# EAGLE board VNA (EAGLE 9.3.1), part 1 of 3
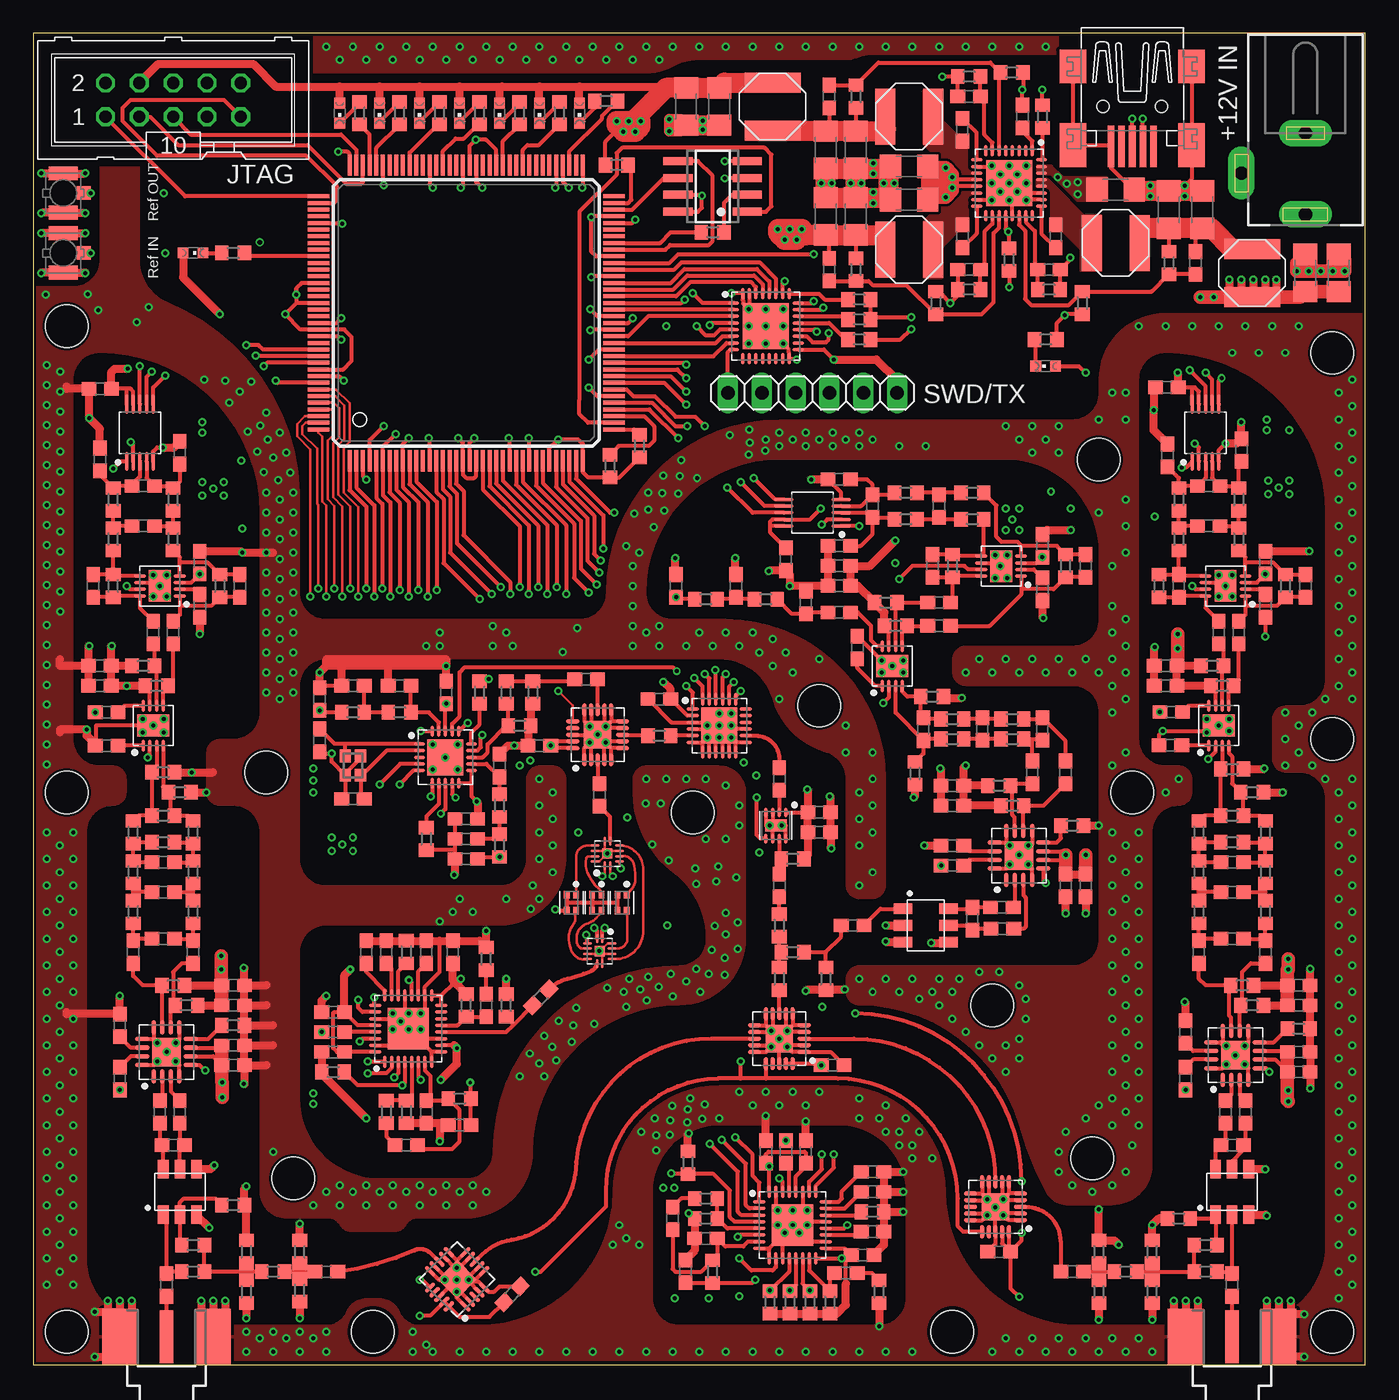
[diagram p10: board, top side]
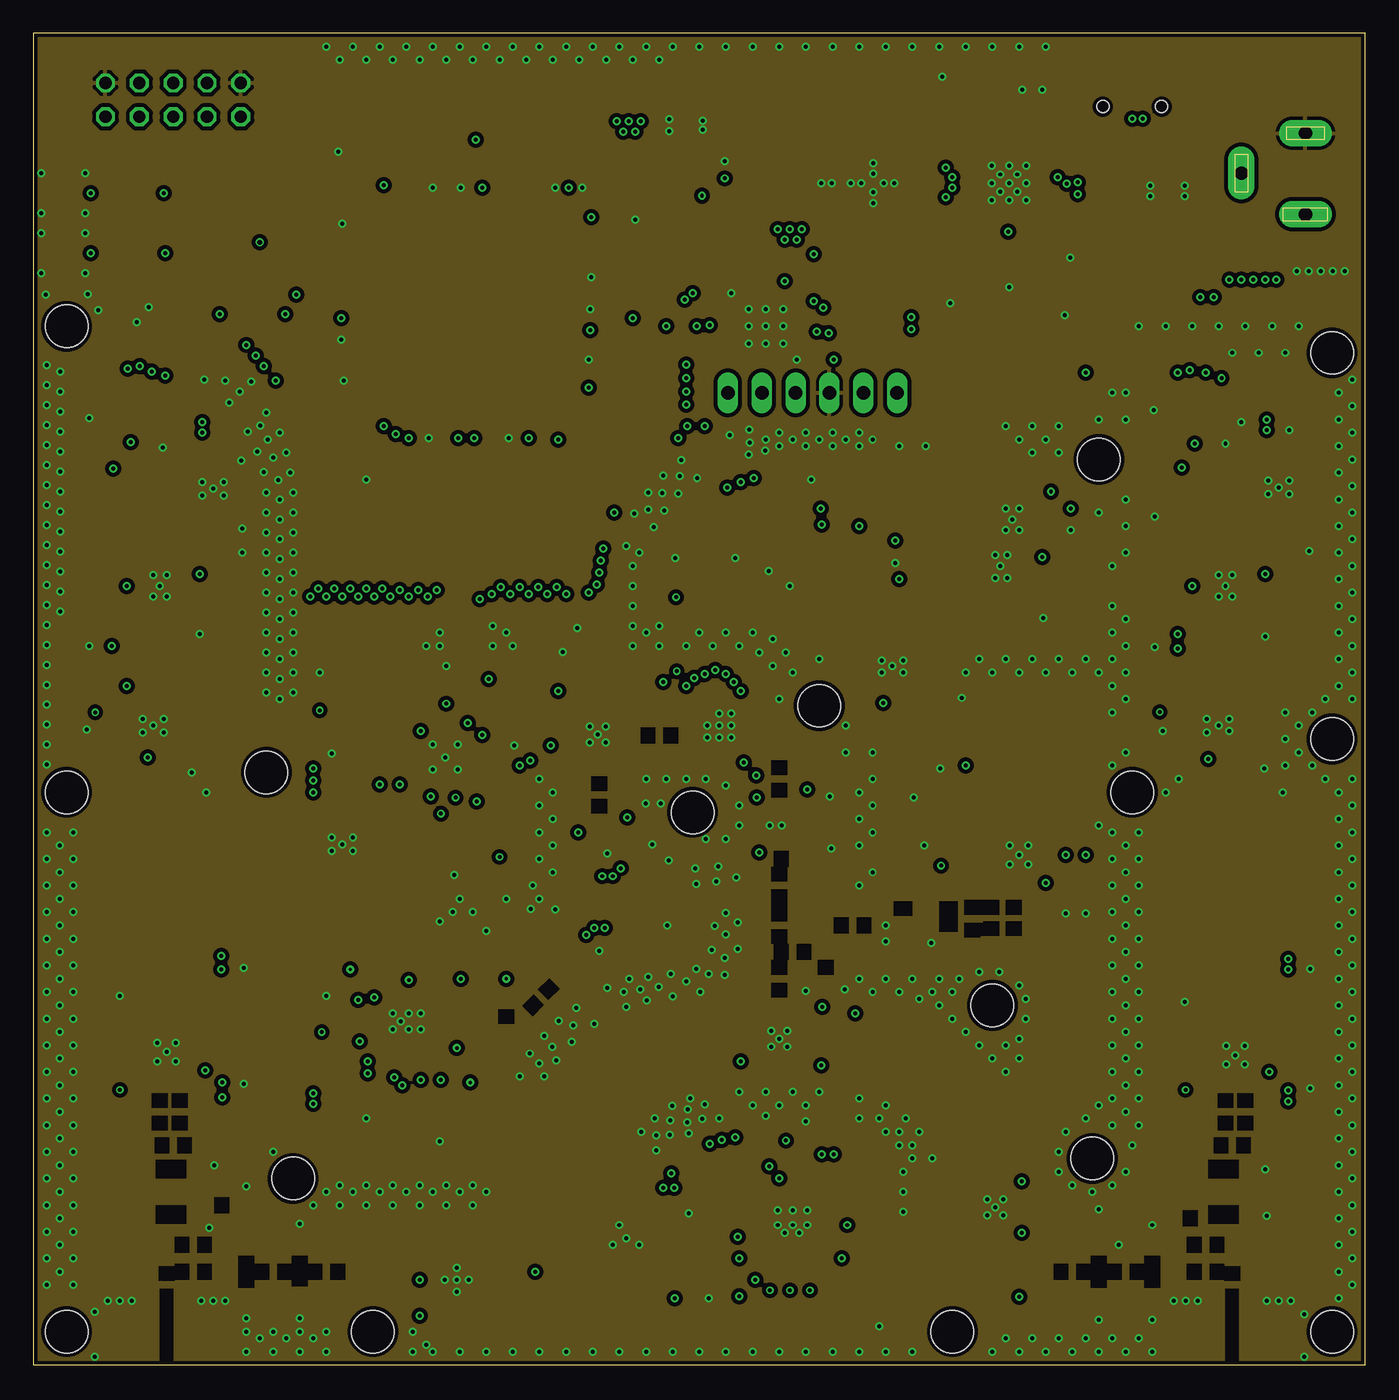
[diagram p11: board, inner layer Route2]
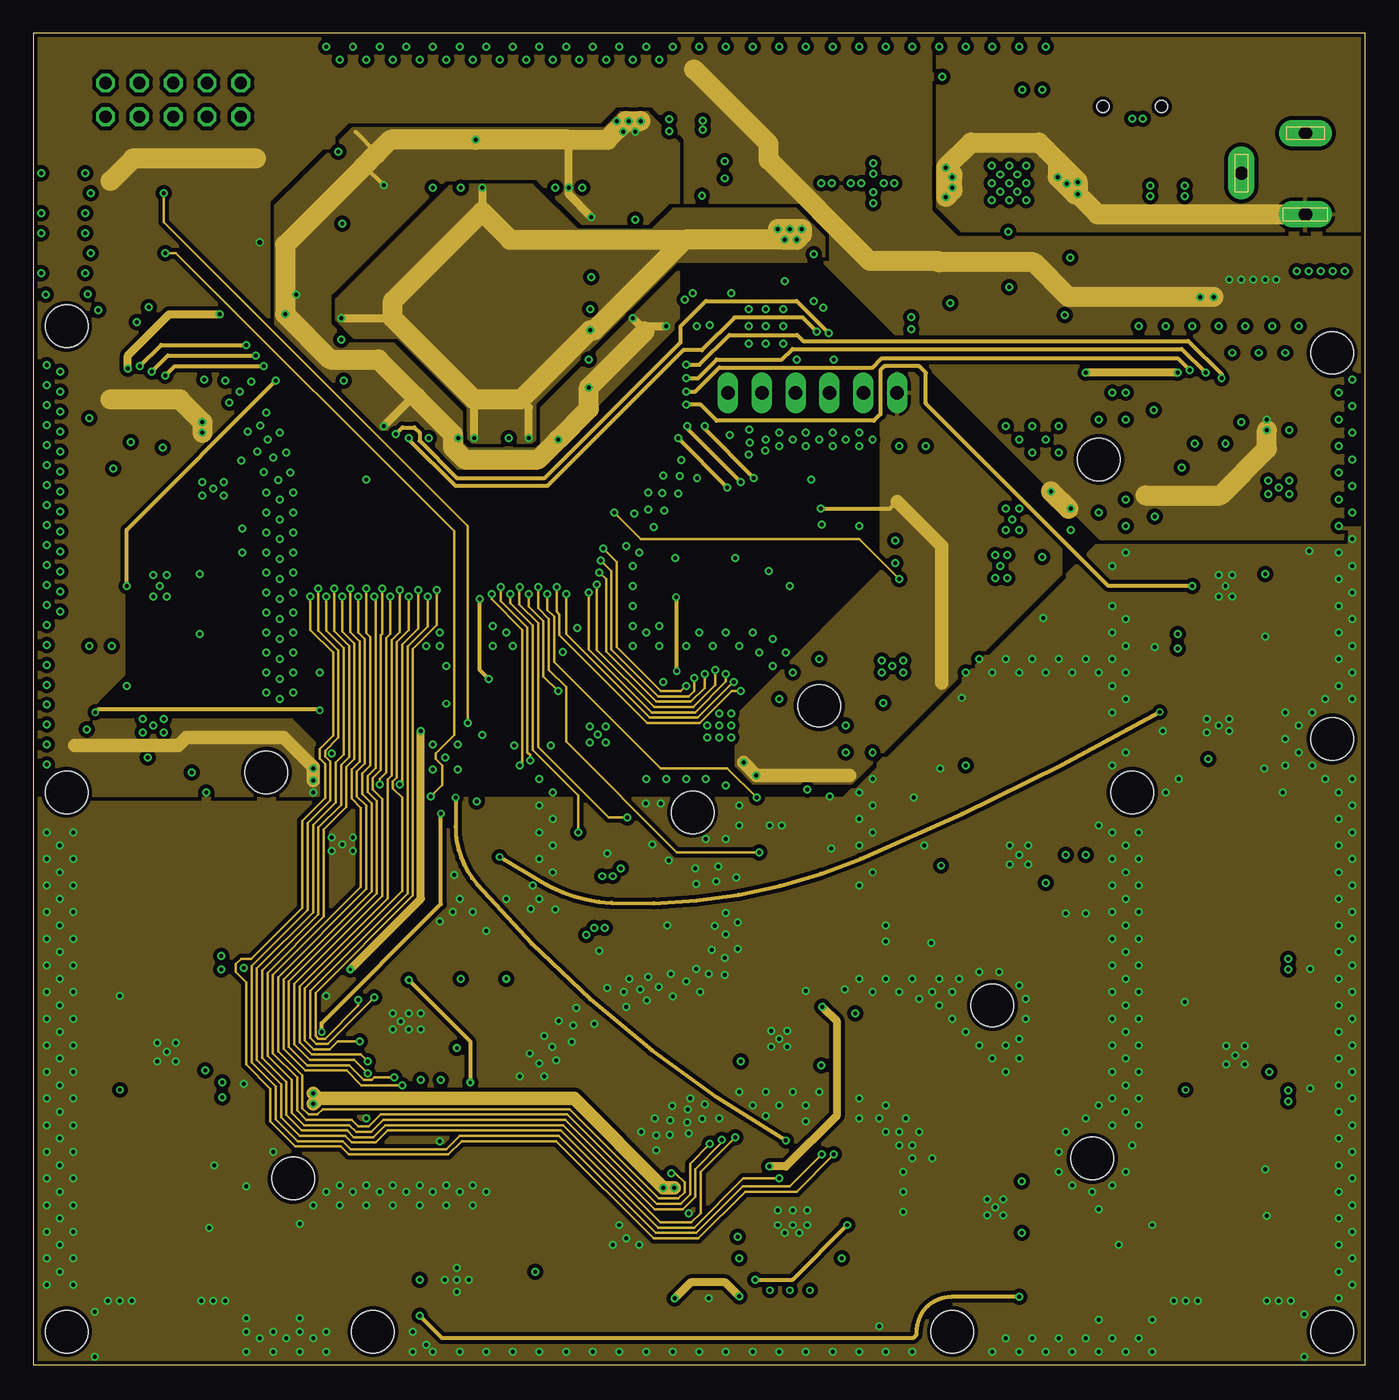
[diagram p12: board, inner layer Route15]
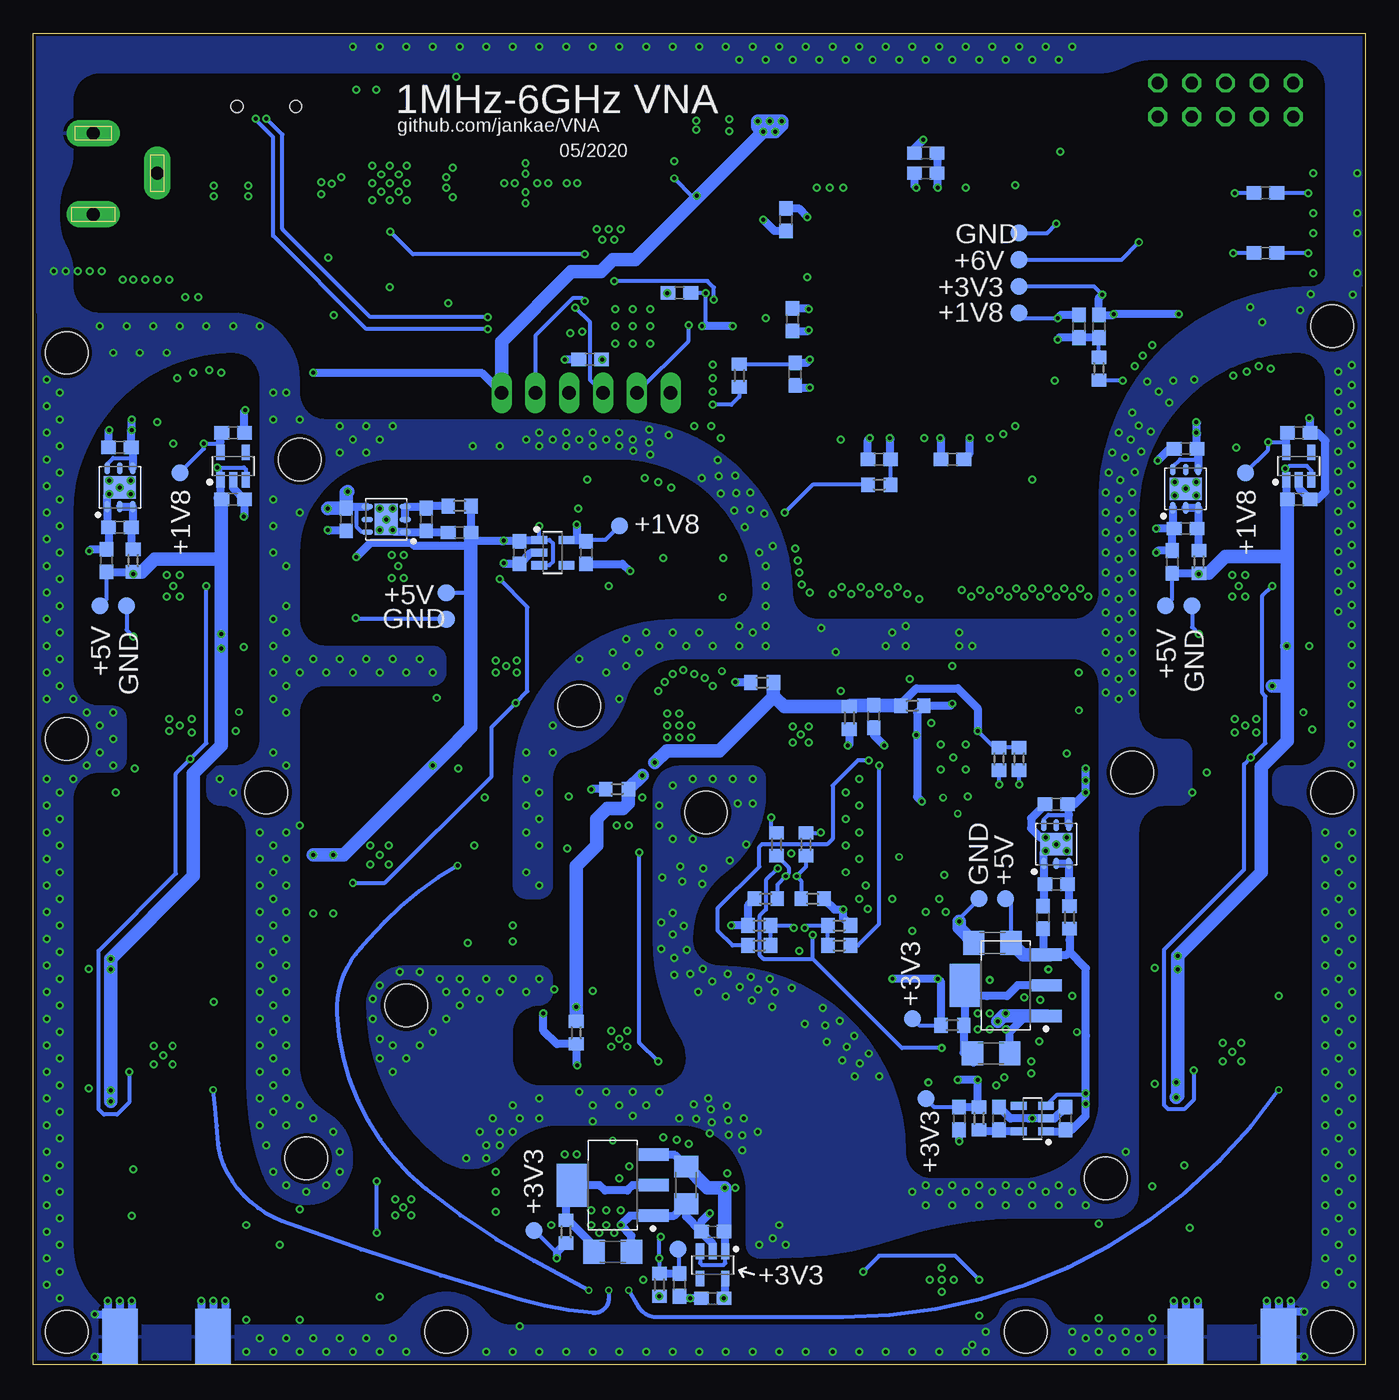
[diagram p13: board, bottom side, seen from below]

Size 100 x 100 mm. Coordinates in mm from the lower left corner, seen from the top.
Outline: 0,0 100,0 100,100 0,100 0,0
Copper layers (1+2*15+16): Top 0.035mm / dielectric 0.2mm / Route2 0.0175mm / dielectric 1.064mm / Route15 0.0175mm / dielectric 0.2mm / Bottom 0.035mm
Design rules "JLCPCB4L_7628 *": minimum track width 6mil, minimum drill 0.2mm, track to track 3.5mil, track to pad 3.5mil, pad to pad 3.5mil, via to via 3.5mil, smd to smd 0mil, copper to edge 0.2mm, drill to drill 0.2mm, minimum pad ring 10mil, minimum via ring 0.125mm, stop-mask expansion 4mil, vias tented up to drill 0mil, thermal gap 10mil
Holes 3.2 mm at 25.5,2.5 2.5,2.5 69,2.5 97.5,2.5 19.5,14 17.5,44.5 2.5,43 82.5,43 97.5,47 79.5,15.5 72,27 49.5,41.5 59,49.5 97.5,76 80,68 2.5,78

## Footprints (pad centres in the part's own frame; a part is rotated, then mirrored left to right if it is on the bottom)
C0603 = smd 1.1 x 1: 1 -0.85,0; 2 0.85,0
C1206 = smd 1.6 x 1.8: 1 -1.4,0; 2 1.4,0
QFN65P400X400X75-17T215N = smd 1.07 x 0.32: 1 -1.83,0.975; 2 -1.83,0.325; 3 -1.83,-0.325; 4 -1.83,-0.975; 9 1.83,-0.975; 10 1.83,-0.325; 11 1.83,0.325; 12 1.83,0.975 | smd 0.32 x 1.07: 5 -0.975,-1.83; 6 -0.325,-1.83; 7 0.325,-1.83; 8 0.975,-1.83; 13 0.975,1.83; 14 0.325,1.83; 15 -0.325,1.83; 16 -0.975,1.83 | smd 2.15 x 2.15: 17 0,0
SON50P300X300X80-9T165X238 = smd 0.917 x 0.27: 1 -1.497,0.75; 2 -1.497,0.25; 3 -1.497,-0.25; 4 -1.497,-0.75; 5 1.497,-0.75; 6 1.497,-0.25; 7 1.497,0.25; 8 1.497,0.75 | smd 1.65 x 2.38: 9 0,0
SOP50P490X110-10N = smd 1.471 x 0.28: 1 -2.15,1; 2 -2.15,0.5; 3 -2.15,0; 4 -2.15,-0.5; 5 -2.15,-1; 6 2.15,-1; 7 2.15,-0.5; 8 2.15,0; 9 2.15,0.5; 10 2.15,1
QFN50P400X400X90-21T270N = smd 0.838 x 0.27: 1 -1.946,1; 2 -1.946,0.5; 3 -1.946,0; 4 -1.946,-0.5; 5 -1.946,-1; 11 1.946,-1; 12 1.946,-0.5; 13 1.946,0; 14 1.946,0.5; 15 1.946,1 | smd 0.27 x 0.838: 6 -1,-1.946; 7 -0.5,-1.946; 8 0,-1.946; 9 0.5,-1.946; 10 1,-1.946; 16 1,1.946; 17 0.5,1.946; 18 0,1.946; 19 -0.5,1.946; 20 -1,1.946 | smd 2.7 x 2.7: 21 0,0
QFN50P500X500X80-33T310 = smd 0.937 x 0.27: 1 -2.487,1.75; 2 -2.487,1.25; 3 -2.487,0.75; 4 -2.487,0.25; 5 -2.487,-0.25; 6 -2.487,-0.75; 7 -2.487,-1.25; 8 -2.487,-1.75; 17 2.487,-1.75; 18 2.487,-1.25; 19 2.487,-0.75; 20 2.487,-0.25; 21 2.487,0.25; 22 2.487,0.75; 23 2.487,1.25; 24 2.487,1.75 | smd 0.27 x 0.937: 9 -1.75,-2.487; 10 -1.25,-2.487; 11 -0.75,-2.487; 12 -0.25,-2.487; 13 0.25,-2.487; 14 0.75,-2.487; 15 1.25,-2.487; 16 1.75,-2.487; 25 1.75,2.487; 26 1.25,2.487; 27 0.75,2.487; 28 0.25,2.487; 29 -0.25,2.487; 30 -0.75,2.487; 31 -1.25,2.487; 32 -1.75,2.487 | smd 3.1 x 3.1: 33 0,0
SOT95P240X110-5 = smd 1.18 x 0.609: 1 -1.024,0.95; 2 -1.024,0; 3 -1.024,-0.95; 4 1.024,-0.95; 5 1.024,0.95
QFN40P180X180X55-13T76N = smd 0.688 x 0.2: 1 -0.921,0.2; 2 -0.921,-0.2; 7 0.921,-0.2; 8 0.921,0.2 | smd 0.2 x 0.688: 3 -0.6,-0.921; 4 -0.2,-0.921; 5 0.2,-0.921; 6 0.6,-0.921; 9 0.6,0.921; 10 0.2,0.921; 11 -0.2,0.921; 12 -0.6,0.921 | smd 0.76 x 0.76: 13 0,0
SOT230P700X180-4 = smd 2.265 x 0.929: 1 -3.073,2.3; 2 -3.073,0; 3 -3.073,-2.3 | smd 2.265 x 3.229: 4 3.073,0
QFN50P400X400X75-21T206 = smd 0.962 x 0.282: 1 -1.875,1; 2 -1.875,0.5; 3 -1.875,0; 4 -1.875,-0.5; 5 -1.875,-1; 11 1.875,-1; 12 1.875,-0.5; 13 1.875,0; 14 1.875,0.5; 15 1.875,1 | smd 0.282 x 0.962: 6 -1,-1.875; 7 -0.5,-1.875; 8 0,-1.875; 9 0.5,-1.875; 10 1,-1.875; 16 1,1.875; 17 0.5,1.875; 18 0,1.875; 19 -0.5,1.875; 20 -1,1.875 | smd 2.06 x 2.06: 21 0,0
QFN50P400X400X75-25T270 = smd 0.96 x 0.27: 1 -1.985,1.25; 2 -1.985,0.75; 3 -1.985,0.25; 4 -1.985,-0.25; 5 -1.985,-0.75; 6 -1.985,-1.25; 13 1.985,-1.25; 14 1.985,-0.75; 15 1.985,-0.25; 16 1.985,0.25; 17 1.985,0.75; 18 1.985,1.25 | smd 0.27 x 0.96: 7 -1.25,-1.985; 8 -0.75,-1.985; 9 -0.25,-1.985; 10 0.25,-1.985; 11 0.75,-1.985; 12 1.25,-1.985; 19 1.25,1.985; 20 0.75,1.985; 21 0.25,1.985; 22 -0.25,1.985; 23 -0.75,1.985; 24 -1.25,1.985 | smd 2.7 x 2.7: 25 0,0
SON50P200X200X80-9T90X160N = smd 0.76 x 0.279: 1 -0.985,0.75; 2 -0.985,0.25; 3 -0.985,-0.25; 4 -0.985,-0.75; 5 0.985,-0.75; 6 0.985,-0.25; 7 0.985,0.25; 8 0.985,0.75 | smd 0.9 x 1.6: 9 0,0
SON95P300X300X100-7T170X240N = smd 0.86 x 0.397: 1 -1.435,0.95; 2 -1.435,0; 3 -1.435,-0.95; 4 1.435,-0.95; 5 1.435,0; 6 1.435,0.95 | smd 1.7 x 2.4: 7 0,0
QFN50P500X500X100-33T345N = smd 0.86 x 0.27: 1 -2.435,1.75; 2 -2.435,1.25; 3 -2.435,0.75; 4 -2.435,0.25; 5 -2.435,-0.25; 6 -2.435,-0.75; 7 -2.435,-1.25; 8 -2.435,-1.75; 17 2.435,-1.75; 18 2.435,-1.25; 19 2.435,-0.75; 20 2.435,-0.25; 21 2.435,0.25; 22 2.435,0.75; 23 2.435,1.25; 24 2.435,1.75 | smd 0.27 x 0.86: 9 -1.75,-2.435; 10 -1.25,-2.435; 11 -0.75,-2.435; 12 -0.25,-2.435; 13 0.25,-2.435; 14 0.75,-2.435; 15 1.25,-2.435; 16 1.75,-2.435; 25 1.75,2.435; 26 1.25,2.435; 27 0.75,2.435; 28 0.25,2.435; 29 -0.25,2.435; 30 -0.75,2.435; 31 -1.25,2.435; 32 -1.75,2.435 | smd 3.45 x 3.45: 33 0,0
U.FL_SMT = smd 1.05 x 2.2: GND1 -1.475,0; GND2 1.475,0 | smd 1 x 1.05: SIG 0,-1.525
DCJ0202 = drill 1 pad 2 long: 1 0,3.1; 2 4.8,0; 3 0,-3
1X06 = drill 1.016 long: 1 -6.35,0; 2 -3.81,0; 3 -1.27,0; 4 1.27,0; 5 3.81,0; 6 6.35,0
ML10 = drill 0.914 octagon: 1 -5.08,-1.27; 2 -5.08,1.27; 3 -2.54,-1.27; 4 -2.54,1.27; 5 0,-1.27; 6 0,1.27; 7 2.54,-1.27; 8 2.54,1.27; 9 5.08,-1.27; 10 5.08,1.27
R0603 = smd 1 x 1.1: 1 -0.85,0; 2 0.85,0
SRN5040 = smd 1.5 x 4.2: P$1 -1.8,0; P$2 1.8,0
CHIPLED_0603 = smd 0.8 x 0.8: A 0,-0.75; C 0,0.75
FILTRDFN160X84X70-4N = smd 0.571 x 0.424: 1 -0.6,0.35; 2 -0.6,-0.35; 3 0.6,-0.35; 4 0.6,0.35
FA-128 = smd 0.95 x 0.85: 1 -0.725,-0.575; 2 0.725,-0.575; 3 0.725,0.575; 4 -0.725,0.575
MACOM_BALUN = smd 1.4 x 0.8: 1 -1.715,1.25; 2 -1.715,0; 3 -1.715,-1.25; 4 1.715,-1.25; 5 1.715,0; 6 1.715,1.25
B1,27 = smd 1.27 x 1.27: TP 0,0
TQ144 = smd 1.6 x 0.3: P1 -11.1,8.75; P2 -11.1,8.25; P3 -11.1,7.75; P4 -11.1,7.25; P5 -11.1,6.75; P6 -11.1,6.25; P7 -11.1,5.75; P8 -11.1,5.25; P9 -11.1,4.75; P10 -11.1,4.25; P11 -11.1,3.75; P12 -11.1,3.25; P13 -11.1,2.75; P14 -11.1,2.25; P15 -11.1,1.75; P16 -11.1,1.25; P17 -11.1,0.75; P18 -11.1,0.25; P19 -11.1,-0.25; P20 -11.1,-0.75; P21 -11.1,-1.25; P22 -11.1,-1.75; P23 -11.1,-2.25; P24 -11.1,-2.75; P25 -11.1,-3.25; P26 -11.1,-3.75; P27 -11.1,-4.25; P28 -11.1,-4.75; P29 -11.1,-5.25; P30 -11.1,-5.75; P31 -11.1,-6.25; P32 -11.1,-6.75; P33 -11.1,-7.25; P34 -11.1,-7.75; P35 -11.1,-8.25; P36 -11.1,-8.75; P73 11.1,-8.75; P74 11.1,-8.25; P75 11.1,-7.75; P76 11.1,-7.25; P77 11.1,-6.75; P78 11.1,-6.25; P79 11.1,-5.75; P80 11.1,-5.25; P81 11.1,-4.75; P82 11.1,-4.25; P83 11.1,-3.75; P84 11.1,-3.25; P85 11.1,-2.75; P86 11.1,-2.25; P87 11.1,-1.75; P88 11.1,-1.25; P89 11.1,-0.75; P90 11.1,-0.25; P91 11.1,0.25; P92 11.1,0.75; P93 11.1,1.25; P94 11.1,1.75; P95 11.1,2.25; P96 11.1,2.75; P97 11.1,3.25; P98 11.1,3.75; P99 11.1,4.25; P100 11.1,4.75; P101 11.1,5.25; P102 11.1,5.75; P103 11.1,6.25; P104 11.1,6.75; P105 11.1,7.25; P106 11.1,7.75; P107 11.1,8.25; P108 11.1,8.75 | smd 0.3 x 1.6: P37 -8.75,-11.1; P38 -8.25,-11.1; P39 -7.75,-11.1; P40 -7.25,-11.1; P41 -6.75,-11.1; P42 -6.25,-11.1; P43 -5.75,-11.1; P44 -5.25,-11.1; P45 -4.75,-11.1; P46 -4.25,-11.1; P47 -3.75,-11.1; P48 -3.25,-11.1; P49 -2.75,-11.1; P50 -2.25,-11.1; P51 -1.75,-11.1; P52 -1.25,-11.1; P53 -0.75,-11.1; P54 -0.25,-11.1; P55 0.25,-11.1; P56 0.75,-11.1; P57 1.25,-11.1; P58 1.75,-11.1; P59 2.25,-11.1; P60 2.75,-11.1; P61 3.25,-11.1; P62 3.75,-11.1; P63 4.25,-11.1; P64 4.75,-11.1; P65 5.25,-11.1; P66 5.75,-11.1; P67 6.25,-11.1; P68 6.75,-11.1; P69 7.25,-11.1; P70 7.75,-11.1; P71 8.25,-11.1; P72 8.75,-11.1; P109 8.75,11.1; P110 8.25,11.1; P111 7.75,11.1; P112 7.25,11.1; P113 6.75,11.1; P114 6.25,11.1; P115 5.75,11.1; P116 5.25,11.1; P117 4.75,11.1; P118 4.25,11.1; P119 3.75,11.1; P120 3.25,11.1; P121 2.75,11.1; P122 2.25,11.1; P123 1.75,11.1; P124 1.25,11.1; P125 0.75,11.1; P126 0.25,11.1; P127 -0.25,11.1; P128 -0.75,11.1; P129 -1.25,11.1; P130 -1.75,11.1; P131 -2.25,11.1; P132 -2.75,11.1; P133 -3.25,11.1; P134 -3.75,11.1; P135 -4.25,11.1; P136 -4.75,11.1; P137 -5.25,11.1; P138 -5.75,11.1; P139 -6.25,11.1; P140 -6.75,11.1; P141 -7.25,11.1; P142 -7.75,11.1; P143 -8.25,11.1; P144 -8.75,11.1
SO08 = smd 0.6 x 2.2: 1 -1.905,-2.6; 2 -0.635,-2.6; 3 0.635,-2.6; 4 1.905,-2.6; 5 1.905,2.6; 6 0.635,2.6; 7 -0.635,2.6; 8 -1.905,2.6
J502-ND-142-0711-821/826 = smd 4 x 1: 1 2.115,0 | smd 4.191 x 2.667: G@1 2.115,3.495; G@2 2.115,-3.495 | smd 4.191 x 2.667 bottom: G@3 2.115,3.495; G@4 2.115,-3.495
32005-301 = smd 3.1 x 0.5: 1 3,1.6; 2 3,0.8; 3 3,0; 4 3,-0.8; 5 3,-1.6 | smd 2.5 x 2: M1 -3,-4.45; M2 -3,4.45 | smd 3.3 x 2: M3 2.9,4.45; M4 2.9,-4.45 | hole 0.9: 0,2.2; 0,-2.2

## Placement (x,y rotation side)
C1  100n  [C0603]  10,6 90 top
C2  100n  [C0603]  22,7 180 top
C3  100n  [C0603]  9.5,19 90 top
C4  100n  [C0603]  11,19 90 top
C5  DNP  [C0603]  10.5,16.5 180 top
C6  100n  [C0603]  6.5,25.5 90 top
C7  100n  [C0603]  6.5,21.5 90 top
C8  10n  [C0603]  15,24 0 top
C9  1u  [C0603]  15,22.5 0 top
C10  10n  [C0603]  12,31 90 top
C11  10n  [C0603]  7.5,31 90 top
C12  100n  [C0603]  15,28.5 0 top
C13  100n  [C0603]  15,27 0 top
C14  120p  [C0603]  9.75,32 0 top
C15  100n  [C0603]  5.5,49 0 top
C16  330p  [C0603]  8.25,66 0 top
C17  330p  [C0603]  5,68 270 top
C18  100n  [C0603]  5.5,46.5 0 top
C19  330p  [C0603]  11,68.5 90 top
C20  1u  [C0603]  9,55 90 top
C21  1u  [C0603]  10.5,55 90 top
C22  100n  [C0603]  5,51 0 top
C23  100n  [C0603]  5,52.5 0 top
C24  DNP  [C0603]  4.5,58.5 90 top
C25  DNP  [C0603]  15.5,58.5 270 top
C26  100n  [C0603]  12.5,57 270 top
C27  330p  [C0603]  8.25,63 0 top
C28  1u  [C0603]  85,65 0 bottom
C29  100n  [C0603]  5.02,73.3 0 top
C30  100n  [C0603]  12.5,60.25 270 top
C31  150p  [C0603]  9.75,35.5 0 top
C32  33p  [C0603]  9.75,37.75 0 top
C33  100n  [C0603]  90,6 90 top
C34  100n  [C0603]  78,7 0 top
C35  100n  [C0603]  89.5,19 90 top
C36  100n  [C0603]  91,19 90 top
C37  DNP  [C0603]  90,16.5 180 top
C38  100n  [C0603]  86.5,25 90 top
C39  100n  [C0603]  86.5,21.5 90 top
C40  10n  [C0603]  95,22 0 top
C41  1u  [C0603]  95,23.5 0 top
C42  10n  [C0603]  87.5,31 90 top
C43  100n  [C0603]  95,28.5 0 top
C44  100n  [C0603]  95,27 0 top
C45  100n  [C0603]  85.37,46.53 0 top
C46  1u  [C0603]  89,55 90 top
C47  1u  [C0603]  90.5,55 90 top
C48  100n  [C0603]  85,51 0 top
C49  100n  [C0603]  85,52.5 0 top
C50  DNP  [C0603]  86,58.5 90 top
C51  DNP  [C0603]  95.5,58.5 270 top
C52  100n  [C0603]  92.5,57 270 top
C53  330p  [C0603]  88.25,63 0 top
C54  100n  [C0603]  92.5,60.25 270 top
C55  10n  [C0603]  92.5,31 90 top
C56  120p  [C0603]  90,32 0 top
C57  150p  [C0603]  90,35.5 0 top
C58  33p  [C0603]  90,37.75 0 top
C59  100n  [C0603]  85.42,49.03 0 top
C60  330p  [C0603]  88.25,66 0 top
C61  330p  [C0603]  85.15,68.3 270 top
C62  330p  [C0603]  90.7,68.7 90 top
C63  1u  [C0603]  85,70 0 bottom
C64  100n  [C0603]  85.1,73.4 0 top
C65  10n  [C0603]  7.5,88 0 bottom
C66  100n  [C0603]  61.5,33 0 top
C67  100n  [C0603]  72.72,34.36 0 top
C68  100n  [C0603]  72.75,32.75 0 top
C69  DNP  [C0603]  70.5,33.5 90 top
C70  100n  [C0603]  69,39 180 top
C71  100n  [C0603]  69,37.5 0 top
C72  10n  [C0603]  79,36 270 top
C73  1u  [C0603]  77.5,36 270 top
C74  10n  [C0603]  75,44.5 90 top
C75  100n  [C0603]  69,42 180 top
C76  100n  [C0603]  69,43.5 180 top
C77  100n  [C0603]  61.86,53.88 270 top
C78  1u  [C0603]  68,57.25 0 top
C79  1u  [C0603]  68,55.5 0 top
C80  100n  [C0603]  60.5,58.5 0 top
C81  100n  [C0603]  60.5,60 0 top
C82  DNP  [C0603]  67.5,60 90 top
C83  DNP  [C0603]  79,60 270 top
C84  100n  [C0603]  75.75,58.25 270 top
C85  330p  [C0603]  68,64.5 90 top
C86  100n  [C0603]  75.75,61.5 270 top
C87  10n  [C0603]  77.5,44.5 90 top
C88  120p  [C0603]  75.75,47.75 90 top
C89  150p  [C0603]  71.25,47.75 90 top
C90  33p  [C0603]  66.82,47.74 90 top
C91  100n  [C0603]  60.5,56.5 0 top
C92  330p  [C0603]  63,64.5 90 top
C93  330p  [C0603]  60.5,61.5 0 top
C94  330p  [C0603]  60.5,66.5 180 top
C95  1u  [C0603]  63.5,61 270 bottom
C96  100n  [C0603]  56.5,60.5 90 top
C97  18p  [C0603]  21.5,50 90 top
C98  56p  [C0603]  24,51 180 top
C99  18p  [C0603]  27.5,51 180 top
C100  18p  [C0603]  32.5,38 180 top
C101  56p  [C0603]  32.5,39.5 180 top
C102  18p  [C0603]  35,45 90 top
C103  18p  [C0603]  58,57.25 90 top
C104  100n  [C0603]  32.5,41 0 top
C105  100n  [C0603]  31,50.5 270 top
C106  1u  [C0603]  13.5,68.8 0 bottom
C107  10n  [C0603]  7.5,83.5 180 bottom
C108  4p  [C0603]  24,42.5 0 top
C109  4p  [C0603]  21.5,46.9 90 top
C110  100n  [C0603]  36.9,48.7 90 bottom
C111  56p  [C0603]  52.75,58.5 90 top
C112  18p  [C0603]  48.25,58.5 90 top
C113  4u7  [C0603]  13.5,62.8 0 bottom
C114  1u  [C0603]  25,31 90 top
C115  1u  [C0603]  29.5,31 90 top
C116  1u  [C0603]  26.5,31 90 top
C117  180p  [C0603]  29.5,19 270 top
C118  18p  [C0603]  32,18 0 top
C119  3n3  [C0603]  28,16.5 180 top
C120  100n  [C0603]  22.5,26.5 180 top
C121  10n  [C0603]  42.5,42.8 90 top
C122  1u  [C0603]  63,14.5 0 top
C123  1u  [C0603]  22.5,18.5 90 bottom
C124  1u  [C0603]  27.5,18.5 90 bottom
C125  10u  [C1206]  28,31.7 180 bottom
C126  10u  [C1206]  28.1,23.4 0 bottom
C127  100n  [C0603]  22.5,23.5 180 top
C128  100n  [C0603]  30.5,18.5 270 bottom
C129  100n  [C0603]  31.5,31 90 top
C130  10n  [C0603]  22.5,25 0 top
C131  10n  [C0603]  34,27 270 top
C132  10n  [C0603]  38.1,27.6 45 top
C133  1u  [C0603]  63,10 0 top
C134  1u  [C0603]  63,13 0 top
C135  180p  [C0603]  50.5,9.5 180 top
C136  18p  [C0603]  48.96,7.03 270 top
C137  3n3  [C0603]  48,11 90 top
C138  100n  [C0603]  58,16 90 top
C139  1u  [C0603]  49,10 180 bottom
C140  1u  [C0603]  49,5 180 bottom
C141  10u  [C1206]  51,13.5 270 bottom
C142  10u  [C1206]  56.5,8.5 0 bottom
C143  100n  [C0603]  55,16 90 top
C144  100n  [C0603]  51.5,6 270 bottom
C145  100n  [C0603]  62.25,8.25 0 top
C146  10n  [C0603]  56.5,16 270 top
C147  10n  [C0603]  61,6.9 180 top
C148  100n  [C0603]  47,50 180 top
C149  100n  [C0603]  38,46.5 180 top
C150  100n  [C0603]  56,44 270 top
C151  100n  [C0603]  59,40 0 top
C152  100n  [C0603]  59,41.5 0 top
C153  100n  [C0603]  56,36 270 top
C154  100n  [C0603]  60,22.5 0 top
C155  100n  [C0603]  72.5,8.5 180 top
C156  100n  [C0603]  35.94,5.3 45 top
C157  100n  [C0603]  41.5,51.5 180 top
C158  1u  [C0603]  93.5,68.9 0 bottom
C159  4u7  [C0603]  93.5,62.9 0 bottom
C160  1u  [C0603]  76.5,63.5 90 bottom
C161  4u7  [C0603]  70.5,63.5 90 bottom
C162  1u  [C0603]  23.2,42.1 0 bottom
C163  4u7  [C0603]  23.2,36.1 0 bottom
C164  1u  [C0603]  14.5,60.3 270 bottom
C165  1u  [C0603]  94.5,60.4 270 bottom
C166  1u  [C0603]  68,62.5 0 bottom
C167  1u  [C0603]  24.2,33.6 270 bottom
C168  1u  [C0603]  74.25,93.75 270 top
C169  22u  [C1206]  61.75,91.25 270 top
C170  22u  [C1206]  85.25,86.75 90 top
C171  22u  [C1206]  87.75,86.75 90 top
C172  22u  [C1206]  59.5,91.25 270 top
C173  10u/25V  [C1206]  65.75,90 180 top
C174  22u  [C1206]  98,82 90 top
C175  47n  [C0603]  69.75,92.75 90 top
C176  510p  [C0603]  70.25,95.25 0 top
C177  10u/25V  [C1206]  81.25,88.25 0 top
C178  47n  [C0603]  76.75,84.75 270 top
C179  DNP  [C0603]  59.75,95.25 90 top
C180  22u  [C1206]  61.75,86.25 90 top
C181  22u  [C1206]  95.5,82 90 top
C182  120p  [C0603]  76.25,82.25 180 top
C183  DNP  [C0603]  87.25,82.75 270 top
C184  22u  [C1206]  59.5,86.25 90 top
C185  10u/25V  [C1206]  65.75,87.5 180 top
C186  47n  [C0603]  69.75,84.75 270 top
C187  1n  [C0603]  70.25,82.25 0 top
C188  8p2  [C0603]  59.75,82.25 270 top
C189  22u  [C1206]  51.5,94.5 270 top
C190  22u  [C1206]  49,94.5 270 top
C191  100n  [C0603]  58.2,75.5 0 bottom
C192  100n  [C0603]  51.5,80.5 180 bottom
C193  1u  [C0603]  5,65 0 bottom
C194  1u  [C0603]  5,70 0 bottom
C195  1u  [C0603]  58.5,61 270 bottom
C203  100n  [C0603]  33,91 0 bottom
C204  100n  [C0603]  43.5,86 270 bottom
C205  100n  [C0603]  42.8,74.4 90 bottom
C206  100n  [C0603]  31,68 0 bottom
C207  100n  [C0603]  20,78 270 bottom
C208  100n  [C0603]  33,89.5 0 bottom
C209  100n  [C0603]  43,78.5 90 bottom
C210  100n  [C0603]  36.5,68 0 bottom
C211  100n  [C0603]  21.5,78 270 bottom
IC1  LTC5510  [QFN65P400X400X75-17T215N]  10,23.5 90 top
IC2  LT5560  [SON50P300X300X80-9T165X238]  9,48 90 top
IC3  LTC6362  [SON50P300X300X80-9T165X238]  9.5,58.5 180 top
IC4  MCP33131D-10-E/MS  [SOP50P490X110-10N]  8,70 90 top
IC5  LTC5510  [QFN65P400X400X75-17T215N]  90.25,23.25 90 top
IC6  LT5560  [SON50P300X300X80-9T165X238]  89,48 90 top
IC7  LTC6362  [SON50P300X300X80-9T165X238]  89.5,58.5 180 top
IC8  MCP33131D-10-E/MS  [SOP50P490X110-10N]  88,70 90 top
IC9  LTC5510  [QFN65P400X400X75-17T215N]  74,38.25 90 top
IC10  LT5560  [SON50P300X300X80-9T165X238]  64.48,52.48 90 top
IC11  LTC6362  [SON50P300X300X80-9T165X238]  72.66,59.98 180 top
IC12  MCP33131D-10-E/MS  [SOP50P490X110-10N]  58.5,64 180 top
IC13  SI5351C  [QFN50P400X400X90-21T270N]  30.94,45.63 0 top
IC14  MAX2871  [QFN50P500X500X80-33T310]  28.15,25.25 90 top
IC15  NCP702-3.3  [SOT95P240X110-5]  25,18.5 180 bottom
IC16  RFSW6042  [QFN40P180X180X55-13T76N]  42.52,31.07 270 top
IC17  AP2114H  [SOT230P700X180-4]  27,28.5 180 bottom
IC18  RFSW6042  [QFN40P180X180X55-13T76N]  43.1,38.4 90 top
IC19  MAX2871  [QFN50P500X500X80-33T310]  57,10.5 0 top
IC20  NCP702-3.3  [SOT95P240X110-5]  49,7.5 270 bottom
IC21  AP2114H  [SOT230P700X180-4]  56.5,13.5 180 bottom
IC22  F2912  [QFN50P400X400X75-21T206]  42.37,47.32 90 top
IC23  F1958  [QFN50P400X400X75-25T270]  51.5,48 0 top
IC24  TRF37A73  [SON50P200X200X80-9T90X160N]  55.75,40.5 270 top
IC25  F2912  [QFN50P400X400X75-21T206]  56,24.5 180 top
IC26  F2912  [QFN50P400X400X75-21T206]  31.81,6.43 135 top
IC27  F2912  [QFN50P400X400X75-21T206]  72.23,11.87 180 top
IC28  LDL212PU50R  [SON95P300X300X100-7T170X240N]  13.5,65.8 90 bottom
IC29  LDL212PU50R  [SON95P300X300X100-7T170X240N]  93.5,65.9 90 bottom
IC30  LDL212PU50R  [SON95P300X300X100-7T170X240N]  73.5,63.5 180 bottom
IC31  LDL212PU50R  [SON95P300X300X100-7T170X240N]  23.2,39.1 90 bottom
IC32  TPS65265  [QFN50P500X500X100-33T345N]  73.25,88.75 270 top
IC33  STM32L432KC  [QFN50P500X500X100-33T345N]  55,78 0 top
IC34  NCP702-1.8  [SOT95P240X110-5]  5,67.5 90 bottom
IC35  NCP702-1.8  [SOT95P240X110-5]  85,67.5 90 bottom
IC36  NCP702-1.8  [SOT95P240X110-5]  61,61 0 bottom
J1  U.FL-R-SMT  [U.FL_SMT]  2.25,83.5 90 top
J2  U.FL-R-SMT  [U.FL_SMT]  2.25,88 90 top
J3  DCJ0202  [DCJ0202]  95.5,89.5 180 top
JP1  [1X06]  58.5,73 180 top
JTAG  [ML10]  10.5,95 0 top
L1  330n  [R0603]  10.5,28.5 180 top
L2  330n  [R0603]  11.5,27 180 top
L3  330n  [R0603]  9.75,44.5 0 top
L4  220Ohm  [R0603]  6,65 90 top
L5  220Ohm  [R0603]  10.5,65 90 top
L6  330n  [R0603]  90.75,28.5 180 top
L7  68n  [R0603]  7.5,34 90 top
L8  68n  [R0603]  12,34 90 top
L9  33n  [R0603]  7.5,37 90 top
L10  33n  [R0603]  12,37 90 top
L11  330n  [R0603]  11,43 0 top
L12  330n  [R0603]  91.5,27 180 top
L13  68n  [R0603]  87.5,34 90 top
L14  68n  [R0603]  92.5,34 90 top
L15  33n  [R0603]  87.5,37 90 top
L16  33n  [R0603]  92.5,37 90 top
L17  330n  [R0603]  90,44.75 0 top
L18  330n  [R0603]  91.5,43 0 top
L19  220Ohm  [R0603]  86,65 90 top
L20  220Ohm  [R0603]  90.5,65 90 top
L21  330n  [R0603]  72.5,43.5 0 top
L22  330n  [R0603]  73.5,42 0 top
L23  68n  [R0603]  73.5,47 180 top
L24  68n  [R0603]  73.5,48.5 180 top
L25  33n  [R0603]  69,47 180 top
L26  33n  [R0603]  69,48.5 180 top
L27  330n  [R0603]  66.19,44.43 270 top
L28  330n  [R0603]  67.47,50.19 0 top
L29  220Ohm  [R0603]  65.5,63.5 180 top
L30  220Ohm  [R0603]  65.5,65.5 180 top
L31  Ferrite  [R0603]  34,49.5 0 bottom
L32  120n  [R0603]  24,49 180 top
L33  120n  [R0603]  27.5,49 180 top
L34  120n  [R0603]  35,39 270 top
L35  120n  [R0603]  35,42 270 top
L36  120n  [R0603]  55,57.5 0 top
L37  120n  [R0603]  50.5,57.5 0 top
L38  Ferrite  [R0603]  31,25.5 180 bottom
L39  Ferrite  [R0603]  29,18.5 90 bottom
L40  Ferrite  [R0603]  60,10 270 bottom
L41  Ferrite  [R0603]  53,6 90 bottom
L42  Ferrite  [R0603]  38.74,48.59 270 bottom
L43  Ferrite  [R0603]  45.29,51.24 180 bottom
L44  330n  [R0603]  57,38 180 top
L45  Ferrite  [R0603]  56.17,43.24 180 bottom
L46  Ferrite  [R0603]  59.24,24.95 270 bottom
L47  Ferrite  [R0603]  12.5,60.3 270 bottom
L48  Ferrite  [R0603]  92.5,60.4 270 bottom
L49  Ferrite  [R0603]  68,64.5 0 bottom
L50  Ferrite  [R0603]  22.2,33.6 270 bottom
L51  10u  [SRN5040]  91.5,82 270 top
L52  6u8  [SRN5040]  81.25,84.25 0 top
L53  6u8  [SRN5040]  65.75,93.75 180 top
L54  6u8  [SRN5040]  65.75,83.75 180 top
L55  10u  [SRN5040]  55.5,94.5 90 top
LED1  [CHIPLED_0603]  76,75 90 top
LED2  [CHIPLED_0603]  12,83.5 270 top
LED3  [CHIPLED_0603]  41,94 180 top
LED4  [CHIPLED_0603]  38,94 180 top
LED5  [CHIPLED_0603]  35,94 180 top
LED6  [CHIPLED_0603]  32,94 180 top
LED7  [CHIPLED_0603]  29,94 180 top
LED8  [CHIPLED_0603]  26,94 180 top
LED9  [CHIPLED_0603]  23,94 180 top
LP1  LP0603A0947ANTR  [FILTRDFN160X84X70-4N]  44.2,34.7 270 top
LP2  LP0603A1880ANTR  [FILTRDFN160X84X70-4N]  40.4,34.7 270 top
LP3  LP0603N3500ANTR  [FILTRDFN160X84X70-4N]  42.3,34.7 270 top
Q1  FA-128 26MHz  [FA-128]  24,45 90 top
R1  620  [R0603]  20,8.5 270 top
R2  620  [R0603]  20,5.6 270 top
R3  18  [R0603]  18,7 0 top
R4  620  [R0603]  16,5.5 90 top
R5  620  [R0603]  16,8.5 90 top
R6  49R9  [R0603]  12,7 0 top
R7  49R9  [R0603]  12,9 0 top
R8  49R9  [R0603]  15,12 0 top
R9  620  [R0603]  80,8.5 270 top
R10  620  [R0603]  80,5.5 270 top
R11  DNP  [R0603]  15,25.5 0 top
R12  18  [R0603]  82,7 180 top
R13  620  [R0603]  84,8.5 270 top
R14  330  [R0603]  24.5,94 270 top
R15  200  [R0603]  8.25,52.5 0 top
R16  200  [R0603]  9.25,51 0 top
R17  6k8  [R0603]  6,58.5 90 top
R18  6k8  [R0603]  14,58.5 270 top
R19  220  [R0603]  10.5,62 270 top
R20  220  [R0603]  6,62 270 top
R21  620  [R0603]  84,5.5 270 top
R22  49R9  [R0603]  88,7 180 top
R23  49R9  [R0603]  88,9 180 top
R24  49R9  [R0603]  86,11 180 top
R25  DNP  [R0603]  95,25.25 0 top
R26  330  [R0603]  27.5,94 270 top
R27  200  [R0603]  88.5,52.5 0 top
R28  200  [R0603]  89.25,51 0 top
R29  6k8  [R0603]  84.5,58.5 90 top
R30  6k8  [R0603]  94,58.5 270 top
R31  220  [R0603]  90.5,62 270 top
R32  220  [R0603]  86,62 270 top
R33  56  [R0603]  9.75,39.25 180 top
R34  20  [R0603]  7.5,40 270 top
R35  20  [R0603]  12,40 270 top
R36  56  [R0603]  9.75,41.25 0 top
R37  56  [R0603]  90,39.25 180 top
R38  20  [R0603]  87.5,40 270 top
R39  20  [R0603]  92.5,40 270 top
R40  56  [R0603]  90,41.25 0 top
R41  DNP  [R0603]  78,40.5 0 top
R42  330  [R0603]  30.5,94 270 top
R43  200  [R0603]  64,57.25 0 top
R44  200  [R0603]  64.75,55.5 0 top
R45  4k7  [R0603]  69,60 90 top
R46  4k7  [R0603]  77.5,60 270 top
R47  220  [R0603]  70.5,65.5 0 top
R48  220  [R0603]  70.5,63.5 0 top
R49  10k  [R0603]  29.5,39.5 90 top
R50  1k8  [R0603]  32,20 0 top
R51  82  [R0603]  26.5,19 90 top
R52  330  [R0603]  28,19 270 top
R53  5k1  [R0603]  28,31 270 top
R54  49R9  [R0603]  32.5,27 90 top
R55  49R9  [R0603]  35.5,27 90 top
R56  10k  [R0603]  22.5,22 0 top
R57  49R9  [R0603]  34,30.5 270 top
R58  1k8  [R0603]  51,7 270 top
R59  82  [R0603]  50.5,12.5 0 top
R60  330  [R0603]  50.5,11 180 top
R61  5k1  [R0603]  63,11.5 180 top
R62  49R9  [R0603]  56.8,4.7 270 top
R63  49R9  [R0603]  55.3,4.7 270 top
R64  10k  [R0603]  49.14,15.19 270 top
R65  49R9  [R0603]  58.3,4.7 270 top
R66  49R9  [R0603]  59.8,4.7 270 top
R67  49R9  [R0603]  63.5,5.5 90 top
R68  0  [R0603]  47,47.25 0 top
R69  2R7  [R0603]  56,33 270 top
R70  2R7  [R0603]  56,29 270 top
R71  406  [R0603]  57,31 180 top
R72  56  [R0603]  59.5,29 90 top
R73  100  [R0603]  36.5,48 0 top
R74  62  [R0603]  35.5,50.5 90 top
R75  100  [R0603]  37.5,50.5 90 top
R76  22  [R0603]  62,78.5 0 top
R77  DNP  [R0603]  75.75,93.75 270 top
R78  51k  [R0603]  73.25,83 90 top
R79  82k  [R0603]  76.25,80.75 180 top
R80  10k  [R0603]  78.75,79.75 90 top
R81  91k  [R0603]  85.25,82.75 90 top
R82  30k  [R0603]  70.25,96.75 0 top
R83  10k  [R0603]  73.45,97.05 180 top
R84  45k3  [R0603]  61.75,95.25 270 top
R85  16k  [R0603]  70.25,80.75 0 top
R86  10k  [R0603]  67.75,79.75 270 top
R87  20k  [R0603]  61.75,82.25 90 top
R88  22  [R0603]  62,77 180 top
R89  1k5  [R0603]  62,80 0 top
R90  10k  [R0603]  26,45.5 90 bottom
R91  22  [R0603]  51,85.05 180 top
R92  10k  [R0603]  43.8,90.1 180 top
R93  10k  [R0603]  43.3,67.5 270 top
R94  10k  [R0603]  45.5,69 270 top
R95  10k  [R0603]  27.5,45.5 90 bottom
R96  22  [R0603]  33.5,50.5 90 top
R97  10k  [R0603]  39.5,33 0 bottom
R98  10k  [R0603]  45.5,33 180 bottom
R99  10k  [R0603]  39.5,31.5 0 bottom
R100  10k  [R0603]  45.5,31.5 180 bottom
R101  10k  [R0603]  41.5,35 0 bottom
R102  10k  [R0603]  45,35 180 bottom
R103  10k  [R0603]  42,39.1 90 bottom
R104  10k  [R0603]  44.2,39.1 90 bottom
R105  330  [R0603]  33.5,94 270 top
R106  330  [R0603]  36.5,94 270 top
R107  330  [R0603]  39.5,94 270 top
R108  330  [R0603]  43,94.9 0 top
R109  330  [R0603]  15,83.5 0 top
R110  330  [R0603]  76,77 0 top
R111  10k  [R0603]  47,74.3 270 bottom
R112  10k  [R0603]  20,74.8 270 bottom
R113  10k  [R0603]  36.5,66.1 180 bottom
T1  MABA011082  [MACOM_BALUN]  11,13 90 top
T2  MABA011082  [MACOM_BALUN]  90,13 90 top
T3  MABA011082  [MACOM_BALUN]  67,33 0 top
TP1  TPB1,27  [B1,27]  26,79 180 bottom
TP2  TPB1,27  [B1,27]  9,67 0 bottom
TP3  TPB1,27  [B1,27]  26,81 180 bottom
TP4  TPB1,27  [B1,27]  89,67 0 bottom
TP5  TPB1,27  [B1,27]  26,83 180 bottom
TP6  TPB1,27  [B1,27]  26,85 180 bottom
TP7  TPB1,27  [B1,27]  15,57 180 bottom
TP8  TPB1,27  [B1,27]  13,57 180 bottom
TP9  TPB1,27  [B1,27]  95,57 180 bottom
TP10  TPB1,27  [B1,27]  93,57 180 bottom
TP11  TPB1,27  [B1,27]  69,58 180 bottom
TP12  TPB1,27  [B1,27]  69,56 180 bottom
TP13  TPB1,27  [B1,27]  27,35 180 bottom
TP14  TPB1,27  [B1,27]  29,35 180 bottom
TP15  TPB1,27  [B1,27]  56,63 0 bottom
TP16  TPB1,27  [B1,27]  34,26 0 bottom
TP17  TPB1,27  [B1,27]  33,20 0 bottom
TP18  TPB1,27  [B1,27]  51.6,8.7 0 bottom
TP19  TPB1,27  [B1,27]  62.4,10.1 0 bottom
U2  6SLX9TQG144  [TQ144]  32.5,79 90 top
U4  W25Q16BVSN  [SO08]  51,88.5 90 top
X1  RLB DUT/RF IN  [J502-ND-142-0711-821/826]  90,0 90 top
X2  RLB DUT/RF IN  [J502-ND-142-0711-821/826]  10,0 90 top
X4  MINI-USB-SCHIELD-32005-301  [32005-301]  82.5,94.5 270 top

## Tracks (layer width: path | path; a pad name or v marks a point on that pad's centre or on a via)
+3V3  (via drill 0.25 pad 0.6, 0.3 pad 0.6)
  Top 0.3: IC19.28 57.25,14.15 58,14.9 C138.1 58,15.9 57.9,16 55.2,16 55,15.8 C143.1 v55.25,14.9 IC19.32 | IC4.9 7.5,73.1 7.3,73.3 7,73.3 | 7,73.3 C29.2 | IC4.10 7,73.3 | IC8.9 87.5,73.1 87.2,73.4 87,73.4 | 87,73.4 C64.2 | IC8.10 87,73.4 | 55.3,63 55.3,63.3 55.5,63.5 IC12.9 58.3,63.5 v59.1,64.3 | 55.3,63 55.3,62.55 C96.2 | IC12.10 55.3,63 | IC14.28 24.35,25.5 C120.1 22.6,26.5 22.5,26.4 22.5,23.8 22.8,23.5 C127.1 IC14.32 | IC13.20 29.12,47.58 v29.1,47.6 | IC33.17 59.35,76.25 v60.1,75.5 | IC33.1 50.25,79.75 v49.5,80.5 | IC33.5 51.54,77.75 51.09,77.3 50.5,77.3 v49.8,78 | R94.2 44,66.65 R93.2 41.65,66.65 41.25,67.05 U2.P36 41.25,69.15 40.9,69.5 v39.4,69.5 38.75,68.85 U2.P31 | v31.9,69.6 32.25,69.25 U2.P18 32.25,66.85 32.5,66.6 33.1,66.6 33.25,66.75 U2.P20 | U2.P125 19.75,79.75 | 19.75,79.75 v18.9,78.9 20.05,77.75 U2.P129 23.35,77.75 23.9,77.2 23.9,75.4 23.25,74.75 U2.P135 | U2.P122 20.15,81.25 19.75,80.85 | 19.75,80.85 19.75,79.75 | v19.75,80.38 19.75,80.85 | U2.P90 32.75,91.55 v33.2,92 34,92 34.75,91.25 U2.P86 | U2.P53 44.65,78.25 v45,78.6 | U2.P42 42.35,72.75 v41.7,73.4 | U4.3 53.56,89.1 v51.9,89.1 | U4.7 50.13,87.86 v50.2,87.8 50.2,86.9 49.9,86.59 U4.8 | U2.P69 41.95,86.25 v41.9,86.2 41.9,83.6 42.25,83.25 U2.P63 | U2.P103 26.25,88.65 v26.3,88.6 | U2.P76 39.75,88.85 v40.2,88.4 | R92.2 42.95,91.85 44.5,93.4 45,93.4 | U2.P4 25.25,69.45 v26.3,70.5 | LED8.A 26.3,94.75 | LED1.A 78.5,75 v79,74.5
  Top 0.6: C120.1 23.35,29.25 v23.8,29.7 | C64.2 85.95,74.45 v85.9,74.5 | C29.2 5.87,74.57 6.1,74.8 v7.1,74.8 | LED9.A 23,96 | 23,96 26,96 | 26,96 29,96 | 29,96 32,96 | 32,96 35.2,96 | 35.2,96 38,96 | 38,96 41,96 | 41,96 47.4,96 47.5,95.9 | LED3.A 41,96 | LED4.A 38,96 | LED5.A 35,95.8 35.2,96 | LED6.A 32,96 | LED7.A 29,96 | LED8.A 26,96 | JTAG.4 9.39,97.7 16.5,97.7 18.2,96 23,96 | LED2.A 11.25,81.65 v14,78.9 | v60.1,75.5 63.3,75.5 64.85,73.95 JP1.1
  Top 1.5: L55.P$2 51.9,96.3 C189.1 C190.1 47.5,95.9 46.45,94.85 45,93.4 v43.8,93.4 43.8,93.1 v44.3,92.6 v45.2,92.6 45.6,93 v45.6,93.4
  Route15 0.3: v59.1,64.3 64.3,64.3 64.85,64.85 | v26.3,88.6 24.9,90 24.8,90 | v40.2,88.4 40.2,92 | 24.2,92.6 25.75,91.05 25.75,90.95 | v31.9,69.6 31.6,69.9 31.5,69.9
  Route15 0.6: v59.24,26.9 60.3,25.84 60.3,18.7 56.5,14.9 v55.25,14.9 | v23.8,29.7 29.1,35 v29.1,47.6 | v85.9,74.5 v79,74.5 | v47.5,78 46.3,78 45.9,77.6 45.9,77.7 v45,78.6 | v41.9,86.2 40.2,87.9 v40.2,88.4 40.2,92 | v26.3,70.5 28.45,72.65 28.75,72.65 | v7.1,74.8 7.1,75.8 10.2,78.9 v14,78.9
  Route15 1: 61.28,44.28 v54.28,44.28 v53.33,45.23 | 68.2,51.2 68.2,61.5 64.85,64.85
  Route15 1.5: 45.9,77.6 v41.7,73.4 41.7,71.8 v39.4,69.5 37.9,68 32.4,68 31.5,68.9 31.5,69.9 28.75,72.65 25.9,75.5 22.3,75.5 v18.9,78.9 18.9,84.1 24.8,90 25.75,90.95 26.8,92 v33.2,92 40.2,92 43.1,92 44.5,93.4 v45.6,93.4
  Bottom 0.3: R90.2 R95.2 27.85,46.35 v29.1,47.6 | C191.1 v60.1,75.5 | C192.1 v49.5,80.5 49.5,78.3 v49.8,78 | v51.9,89.1 50.6,87.8 v50.2,87.8 50.2,87.6 50.65,87.15 | TP3.TP 20.38,81 v19.75,80.38
  Bottom 0.6: L31.1 34.85,49.65 33.7,50.8 30.6,50.8 29.1,49.3 v29.1,47.6 | v79,74.5 66.35,74.5 JP1.1 64.85,72.65 | C191.1 v60.1,75.5 | v47.5,78 v49.8,78 | C203.1 33.85,91.35 v33.2,92 | C204.1 42.55,86.85 v41.9,86.2 | C205.1 42.65,73.4 v41.7,73.4 | C206.1 31.85,69.55 v31.9,69.6 | 18.95,78.85 C207.1 20,80.12 v19.75,80.38 | 18.95,78.85 v18.9,78.9 | v14,78.9 v18.9,78.9 | v18.9,78.9 18.95,78.85
  Bottom 1: L46.1 v59.24,26.9 59.24,37.46 57.7,39 57.7,41 56.9,41.8 55.7,41.8 55.32,42.18 L45.1 v54.28,44.28 | v53.33,45.23 52.46,46.1 48.5,46.1 44.4,50.2 | 44.4,50.2 44.44,50.24 L43.1 | L31.1 37,49.5 | 37,49.5 38.68,49.5 L42.1 43.64,49.44 44.4,50.2 | C110.2 37,49.5 | JP1.1 64.85,76.85 59.6,82.1 57.4,82.1 56.5,83 54.8,83 50.65,87.15 v45.2,92.6 | v45.2,92.6 v44.3,92.6 | v44.3,92.6 44.3,92.9 v43.8,93.4 | v43.8,93.4 v45.6,93.4 45.6,93 v45.2,92.6 | v44.3,92.6 43.8,93.1 v43.8,93.4
  other vias: 44.7,93.4
  pour Route15 (isolate 0.3, rank 2): 48.4,78.2 48.4,91.7 46.1,94 44.1,94 42.9,92.8 24,92.8 20.4,89.2 18.2,87 18.2,78.8 18.2,78.2 26.1,70.3 28.7,70.3 31.6,67.4 37.6,67.4
  pour Route15 (isolate 0.3, rank 5): 63.7,74.6 65.9,74.6 66.7,73.8 77.1,63.4 77.1,60.1 77.1,59.4 61.4,43.7 54.1,43.7 52.8,45 52.8,48.7 54.8,50.7 63.7,59.6
+5V/1  (via drill 0.3 pad 0.6)
  Top 0.3: IC1.7 13.97,23.82 C8.1 | IC1.6 13.47,23.18 C9.1 | IC2.7 8.75,50.65 R16.1 | IC3.3 11.85,58.75 C30.2 | IC4.1 6.55,67.85 v6,67.3
  Top 0.6: L1.1 C12.1 | L2.1 C13.1 | C9.1 C8.1 | R15.1 C23.2 | R16.1 C22.2 C23.2 | C23.2 5.85,53.95 v5.9,54
  Top 1: C13.1 C12.1 14.1,28.55 v14.1,29.7 v14.1,30.7 | C8.1 C9.1 14.15,21.25 v14.2,21.2 v14.2,20.1
  Bottom 0.3: v6,67.3 5.95,67.25 | 5.95,67.25 IC34.1 | IC34.3 4.05,67.15 4.4,67.5 5.7,67.5 5.95,67.25 | TP7.TP 14.5,57.5 C164.2
  Bottom 0.6: C164.2 L47.2 C30.2 | IC34.1 5.95,65.1 C193.1
  Bottom 1: L47.2 11.75,59.45 10.5,60.7 5.95,60.7 5.85,60.8 | C193.1 5.85,60.8 | 5.85,60.8 5.85,53.9 | 5.85,53.9 C23.2 C22.2 | C22.2 5.85,46.85 7.8,44.9 7.8,37 v14.1,30.7 v14.1,29.7 14.1,20.2 v14.2,20.1 | v7,51 C22.2 | v5.9,54 5.9,53.95 5.85,53.9
  other vias: 12.5,59.4
+5V/2  (via drill 0.3 pad 0.6)
  Top 0.3: IC5.7 94.08,23.57 C41.1 | IC5.6 93.22,22.93 C40.1 | IC6.7 88.75,50.65 R28.1 | IC7.3 91.85,58.75 C54.2 | IC8.1 86.55,67.4 v86.2,67.4
  Top 0.6: R27.1 C49.2 C48.2 R28.1 | L6.1 C43.1 | L12.1 C44.1
  Top 1: C41.1 C40.1 94.15,19.85 v94.2,19.8 | C44.1 C43.1 94.15,29.65 v94.2,29.7 v94.2,30.5 | v85.9,54.9 v85.9,53.8 85.9,52.55 C49.2
  Bottom 0.3: IC35.3 84.05,67.25 84.2,67.4 v86.2,67.4 85.95,67.15 IC35.1 | TP9.TP 94.5,57.5 C165.2
  Bottom 0.6: IC35.1 85.95,65.1 C28.1 | C54.2 L48.2 C165.2
  Bottom 1: v94.2,19.8 v94.2,20.6 v94.2,30.5 88,36.7 88,44.4 85.9,46.5 v85.9,53.8 v85.9,54.9 85.9,60.6 | 85.9,60.6 85.9,65.05 85.95,65.1 | L48.2 91.85,59.55 90.9,60.5 86,60.5 85.9,60.6
  other vias: 92.5,59.4
+5V/3  (via drill 0.3 pad 0.6)
  Top 0.3: IC9.6 77.08,37.92 77.5,37.5 C73.1 | IC10.7 64.23,55.17 R44.1 | IC11.3 75.33,60.23 C86.2 | v62,63 IC12.1 | IC9.7 77.22,38.58 v77.5,38.3
  Top 0.6: L21.1 C76.1 | L22.1 C75.1 C76.1 | C73.1 C72.1 | R44.1 63.9,56.5 R43.1 61.9,58.5 C80.2 C81.2 62.8,60 v64.7,61.9 | C76.1 69.85,44.85 v70,45
  Top 1: C72.1 v79,38.3 | C73.1 v77.5,38.3
  Bottom 0.3: IC36.3 61.25,60.05 61,60.3 61,61.7 61.25,61.95 IC36.1 62,61.97 v62,63 | TP11.TP 67.25,58 67.15,58.1
  Bottom 0.6: L49.2 C166.2 | IC36.1 63.4,61.95 C95.1 64.8,61.85 | v70,45 69.2,45.8 | 64.8,61.85 67.1,61.85 67.15,61.8 67.45,61.5 71.4,61.5 71.6,61.7 74.7,61.7 C86.2 | v64.7,61.9 64.75,61.85 64.8,61.85
  Bottom 1: C166.2 67.15,61.8 67.15,58.1 67.15,47.85 69.2,45.8 76.7,38.3 v79,38.3
  other vias: 75.75,60.65
+5V/4  (via drill 0.3 pad 0.6)
  Route15 1: v48.1,13.3 v47.3,13.3 40.6,20 21.4,20 | 21.4,20 v21,20.4 | v21,19.6 21.4,20
  Bottom 0.3: IC20.3 49.95,7.65 49.8,7.5 48.2,7.5 48.05,7.65 IC20.1 | IC15.3 23.12,20.3 21.1,20.3 v21,20.4 | C125.1 26.6,34.6 TP13.TP
  Bottom 0.6: IC21.3 51.9,15.8 C141.1 | IC20.1 48.05,9.9 C139.1 | IC15.1 22.6,17.55 C123.1 22.05,17.65 21,18.7 v21,20.4 21,24.71 20.99,24.73 20.99,29.79 22.2,31 | C167.2 24.2,31.07 IC17.3 23.7,30.8 22.4,30.8 22.2,31 | L50.2 22.2,31.9 22.2,31
  Bottom 1: C141.1 49.4,13.3 v48.1,13.3 48.1,10.05 C139.1 | C125.1 25.7,30.8 23.7,30.8
+12V  (via drill 0.3 pad 0.6)
  Top 0.3: IC32.12 69.2,89 v69,89.2 | IC32.13 69.3,88.5 69,88.2
  Top 1: C173.1 C185.1 | C185.1 67.35,87.7 v68.5,87.7 69,88.2 v69,89.2 | C173.1 67.25,89.9 v68.5,89.9 69,89.4 v69,89.2 | C173.1 67.15,89.2 v69,89.2 | C185.1 67.15,88.4 v69,88.4
  Route15 1.5: v68.5,89.9 68.5,89.1 | 68.5,89.1 v68.5,87.7 69,88.2 v69,88.4 v69,89.2 | v69,89.2 68.9,89.1 68.5,89.1 | v68.5,89.9 69,89.4 v69,89.2 | v68.5,89.9 70.4,91.8 75.5,91.8 76.05,91.25 | 76.05,91.25 76.9,90.4 v76.9,89.2 78.2,87.9 | 78.2,87.9 v78.4,87.9 79.9,86.4 J3.1 | 76.05,91.25 78.4,88.9 v78.4,88.8 78.4,88.1 78.2,87.9
  other vias: 77.6,88.7
  pour Top (isolate 0.2, rank 2, no thermals): 80.6,89.1 77.3,89.1 76.4,90 75.4,90 75.4,89.5 76.2,89.5 76.6,89.1 78.2,87.5 80.6,87.5
  pour Route15 (isolate 0.3, rank 2): 100.5,100.6 68,100.6 67.9,100.7 67.9,87 68.8,86.1 69.7,85.2 98.4,85.2 100.6,85.2 100.6,100.5
AMP_PWDN  (via drill 0.3 pad 0.6)
  Top 0.3: IC24.5 54.59,39.52 54.3,39.8 v54.3,42.6 | U2.P24 35.25,66.4 38.6,63.05 v38.6,57.9
  Route15 0.2: v54.3,42.6 52.1,44.8 47.1,44.8 39.1,52.8 39.1,56.19 38.6,56.69 v38.6,57.9
ATT_D0  (via drill 0.3 pad 0.6)
  Top 0.3: IC23.1 49.52,50.48 v49,51 | U2.P34 40.25,66.35 42.8,63.8 v42.8,61.3
  Route15 0.2: v49,51 48.6,50.6 47.1,50.6 43.8,53.9 43.8,60.3 v42.8,61.3
ATT_D1  (via drill 0.3 pad 0.6)
  Top 0.3: IC23.24 50.25,50.95 v49.6,51.6 | U2.P33 39.75,66.14 42.1,63.79 42.1,60.9 v42.6,60.4
  Route15 0.2: v49.6,51.6 49.6,50.6 49.2,50.2 46.93,50.2 43.4,53.73 43.4,59.6 v42.6,60.4
ATT_D2  (via drill 0.3 pad 0.6)
  Top 0.3: IC23.23 50.75,51.55 v50.4,51.9 | U2.P32 39.25,65.94 41.6,63.59 41.6,60.4 v42.5,59.5
  Route15 0.2: v50.4,51.9 50.4,50.83 49.37,49.8 46.77,49.8 43,53.57 43,59 v42.5,59.5
ATT_D3  (via drill 0.3 pad 0.6)
  Top 0.3: IC23.22 51.25,52.15 v51.2,52.2 | U2.P30 38.25,66.23 41.1,63.38 41.1,59.8 v42.3,58.6
  Route15 0.2: v51.2,52.2 51.2,51.07 49.53,49.4 46.6,49.4 42.3,53.7 v42.3,58.6
ATT_D4  (via drill 0.3 pad 0.6)
  Top 0.3: IC23.21 51.75,51.65 v52,51.9 | U2.P29 37.75,66.02 40.6,63.17 40.6,59.09 v41.69,58 v41.7,58
  Route15 0.2: v52,51.9 52,51.3 49.7,49 46.44,49 41.7,53.74 v41.7,58
ATT_D5  (via drill 0.3 pad 0.6)
  Top 0.3: IC23.20 52.25,50.95 v52.6,51.3 | U2.P27 36.75,66.31 40,63.06 v40,57.9
  Route15 0.2: v52.6,51.3 52.56,51.3 49.86,48.6 46.27,48.6 40,54.87 v40,57.9
ATT_D6  (via drill 0.3 pad 0.6)
  Top 0.3: IC23.19 52.75,50.25 v53.1,50.6 | U2.P26 36.25,66.11 39.3,63.06 v39.3,58.4
  Route15 0.2: v53.1,50.6 52.43,50.6 50.03,48.2 46.11,48.2 39.5,54.81 39.5,56.36 39.28,56.58 39.28,58.38 v39.3,58.4
BAND_SELECT  (via drill 0.3 pad 0.6)
  Top 0.2: IC22.16 40.49,49.51 v39.4,50.6
  Top 0.3: U2.P22 34.25,65.99 37.2,63.04 v37.2,57.9
  Route15 0.2: v39.4,50.6 38.3,51.7 38.3,55.86 37.2,56.96 v37.2,57.9
FILT_IN_C1  (via drill 0.3 pad 0.6)
  Top 0.3: U2.P15 30.75,65.76 31.3,65.21 31.3,61 v34.4,57.9
  Route15 0.2: v36.5,45 36.7,45.2 36.7,55.2 34.4,57.5 v34.4,57.9
  Bottom 0.3: R99.2 38.1,31.5 36.5,33.1 v36.5,45
FILT_IN_C2  (via drill 0.3 pad 0.6)
  Top 0.3: U2.P16 31.25,65.97 31.8,65.42 31.8,61.7 v35.1,58.4
  Route15 0.2: v37.3,45.4 37.3,45.8 37.1,46 37.1,55.37 35.1,57.37 v35.1,58.4
  Bottom 0.3: R100.2 47.5,31.5 48.6,32.6 48.6,34.3 45.5,37.4 45.5,38.9 45.3,39.1 40.4,39.1 40,39.5 40,43.5 38.1,45.4 v37.3,45.4
FILT_OUT_C1  (via drill 0.3 pad 0.6)
  Top 0.3: U2.P21 33.75,65.75 36.5,63 v36.5,58.4
  Route15 0.2: v36.5,58.4 36.5,57.1 37.9,55.7 37.9,46.4 43.2,41.1 v44.6,41.1
  Bottom 0.3: R104.2 44.6,40.35 v44.6,41.1
FILT_OUT_C2  (via drill 0.3 pad 0.6)
  Top 0.3: U2.P17 31.75,66.18 32.3,65.63 32.3,62.3 35.8,58.8 v35.8,57.9
  Route15 0.2: v40.9,40 40.9,42.77 37.5,46.17 37.5,55.53 35.8,57.23 v35.8,57.9
  Bottom 0.3: R103.2 40.95,39.95 v40.9,40
FLACH_MOSI
  Top 0.3: U4.5 49.9,90.41 51,89.3 51,84.4 50.7,84.1 47.8,84.1 47.45,83.75 U2.P64
FLASH_CLK
  Top 0.3: U2.P70 44.95,86.75 47.34,89.14 U4.6
FLASH_CS
  Top 0.3: U2.P38 41.65,70.75 41,71.4 41,72.5 41,86.6 43.8,89.4 43.8,91 44.2,91.4 54.9,91.4 55.4,90.9 55.4,87 54.99,86.59 U4.1
FLASH_MISO
  Top 0.3: U4.2 52.47,87.86 51.85,87.25 R91.1
FPGA_CLK
  Top 0.3: IC13.15 32.89,47.49 33.5,48.1 R96.1
FPGA_RESET
  Top 0.3: IC33.7 52.05,76.75 51.05,75.75 U2.P48
GND  (via drill 0.3 pad 0.6)
  Top 0.2: IC16.12 43.12,31.67 42.58,31.12 | 42.58,31.12 IC16.13 | IC18.12 42.5,37.8 IC18.13 | IC16.5 42.52,30.87 IC16.13 | IC16.8 42.72,30.87 IC16.13 | IC16.10 42.83,30.87 42.58,31.12 | IC18.5 43.3,38.6 IC18.13 | IC18.10 42.9,38.6 | 42.9,38.6 IC18.13 | IC18.8 42.9,38.6 | 42.9,38.6 IC18.13
  Top 0.3: IC19.31 55.75,11.75 IC19.33 | IC19.27 57.75,11.25 IC19.33 | IC19.21 57.25,10.75 IC19.33 | IC19.18 58.25,9.25 IC19.33 | IC19.11 56.25,9.75 56.9,10.4 | 56.9,10.4 IC19.33 | IC19.9 55.25,8.75 | 55.25,8.75 56.9,10.4 | 56.9,10.4 IC19.33 | IC19.8 55.25,8.75 | 55.25,8.75 56.9,10.4 | IC1.16 9.03,22.52 v9.3,22.8 IC1.17 | IC1.4 10.97,22.52 v10.7,22.8 10.1,23.4 | 10.1,23.4 IC1.17 | IC1.13 9.03,24.48 | 9.03,24.48 v9.3,24.2 | v9.3,24.2 IC1.17 | IC1.17 10.1,23.4 | IC1.12 9.03,24.48 | 9.03,24.48 v9.3,24.2 | v9.3,24.2 IC1.17 | IC1.9 10.97,24.48 v10.7,24.2 IC1.17 | IC2.9 4.7,48 4.7,46.55 C18.1 | IC3.6 9.25,58.75 IC3.9 | IC4.5 9,68.6 9.3,68.9 v9.7,68.9 | IC5.16 89.28,22.27 90.15,23.15 | 90.15,23.15 IC5.17 | IC5.4 91.22,22.27 IC5.17 | IC5.12 89.28,24.02 90.15,23.15 | IC5.13 89.08,24.23 90.15,23.15 | IC5.9 91.22,24.23 IC5.17 | IC5.17 90.15,23.15 | C45.1 84.52,47.32 v84.8,47.6 88.6,47.6 IC6.9 | C52.2 v92.5,54.7 | IC8.5 89,68.7 v89.5,69.2 | IC7.6 89.25,58.75 IC7.9 | IC24.6 55.5,40.25 IC24.9 | IC24.3 55.5,40.75 IC24.9 | IC24.4 55,40.5 IC24.9 | IC24.8 56.5,40.5 v56.2,40.5 | v56.2,40.5 IC24.9 | IC9.13 73.03,39.23 | 73.03,39.23 73.12,39.12 | 73.12,39.12 IC9.17 | IC9.12 73.03,39.23 | 73.03,39.23 73.12,39.12 | IC9.16 73.03,37.27 IC9.17 | IC9.4 74.97,37.27 74.08,38.17 | 74.08,38.17 IC9.17 | IC9.9 74.97,39.08 74.08,38.17 | IC11.6 72.37,60.23 v72.6,60 72.62,59.98 IC11.9 | C77.1 v63.69,52.9 v63.7,52.9 | IC12.5 60.65,65.5 C94.2 | C98.2 21.65,51 C97.2 | Q1.2 24.57,45.58 23.43,44.42 Q1.4 | Q1.4 23.43,42.77 C108.1 | Q1.4 23.27,44.27 | C104.1 C101.2 31.65,38.7 | 31.65,38.7 C100.2 | R49.1 29.55,38.7 31.65,38.7 | IC14.21 27.9,25.5 | 27.9,25.5 28.1,25.3 | 28.1,25.3 IC14.33 29.4,26.5 IC14.18 29.4,28.4 30.5,29.5 30.5,31.85
  Top 0.3: IC14.11 28.9,24.5 v28.2,25.2 | v28.2,25.2 28.1,25.3 | IC14.9 29.9,23.5 | 29.9,23.5 v28.2,25.2 | v28.2,25.2 28.1,25.3 | IC14.8 29.9,23.5 | 29.9,23.5 v28.2,25.2 | v28.2,25.2 28.1,25.3 | IC14.27 27.4,26 27.9,25.5 | IC14.31 26.8,24 28.1,25.3 | IC26.18 31.78,6.4 | 31.78,6.4 v31.8,6.4 | IC26.2 31.78,5.75 | 31.78,5.75 31.78,6.4 | IC26.1 31.78,5.04 31.78,5.75 | IC26.4 32.72,6.22 | 32.72,6.22 32.52,6.43 | 32.52,6.43 IC26.21 31.81,5.78 31.78,5.75 | 32.72,6.22 33.43,6.22 IC26.5 34.16,5.5 34.6,5.5 35,5.9 C156.2 | IC26.6 33.23,6.43 32.52,6.43 | IC26.7 32.52,6.43 | 32.52,6.43 | IC26.9 31.98,7.3 v31.8,7.3 | IC26.10 31.8,7.83 v31.8,7.3 | IC26.11 31.8,7.86 v31.8,7.3 | IC26.12 31.65,7.3 v31.8,7.3 | IC26.14 30.9,6.63 v30.9,6.4 30.43,6.4 IC26.15 | v72.23,11.85 IC27.18 72.23,9.08 C155.2 | v72.23,11.85 v72.22,11.85 | IC27.1 73.2,10.87 72.64,11.44 | 72.64,11.44 v72.23,11.85 | IC27.2 72.7,11.37 72.64,11.44 | IC27.4 72.73,12.37 | 72.73,12.37 72.53,12.17 | 72.53,12.17 72.33,11.97 | 72.33,11.97 IC27.21 | IC27.5 73.23,12.87 | 73.23,12.87 72.88,12.52 | 72.88,12.52 72.73,12.37 | IC27.6 73.23,12.87 | 73.23,12.87 72.88,12.52 | IC27.7 72.73,12.37 | 72.73,12.37 72.53,12.17 | 72.53,12.17 72.33,11.97 | IC27.9 71.73,12.37 | 71.73,12.37 71.9,12.2 | 71.9,12.2 72.1,12 | 72.1,12 IC27.21 | IC27.10 71.23,12.87 | 71.23,12.87 71.9,12.2 | 71.9,12.2 72.1,12 | 72.1,12 IC27.21 | IC27.11 71.23,12.87 | 71.23,12.87 71.9,12.2 | 71.9,12.2 72.1,12 | IC27.12 71.73,12.37 | 71.73,12.37 71.9,12.2 | IC27.14 71.47,11.37 71.8,11.7 | 71.8,11.7 72.1,12 | IC27.15 71.25,10.87 v71.62,11.25 71.62,11.27 IC27.21 | IC25.12 55.5,25 | 55.5,25 IC25.21 | IC25.11 55,25.5 | 55,25.5 55.5,25 | IC25.10 55,25.5 | 55,25.5 55.5,25 | IC25.9 55.5,25 | IC25.7 56.5,25.2 v56.6,25.1 57,25.5
  Top 0.3: IC25.6 57,25.5 | IC25.5 57,25.5 | 57,25.5 56.15,24.65 | 56.15,24.65 IC25.21 | IC25.4 56.5,25 56.15,24.65 | IC25.2 56.5,24 IC25.21 | v56.6,23.9 57,23.5 IC25.1 59.85,23.5 C154.2 | IC25.14 55.3,24 v55.4,23.9 55,23.5 IC25.15 | IC25.18 IC25.21 | IC22.15 41.37,48.33 v41.77,47.92 41.87,48.02 IC22.14 | IC22.12 42.87,47.82 | 42.87,47.82 42.67,47.62 | 42.67,47.62 42.52,47.48 | 42.52,47.48 v42.38,47.33 | IC22.11 43.37,48.32 | 43.37,48.32 42.67,47.62 | IC22.10 43.37,48.32 | 43.37,48.32 42.52,47.48 | IC22.9 42.87,47.82 | 42.87,47.82 42.52,47.48 | IC22.7 43.18,46.82 42.9,47.1 42.52,47.48 | IC22.6 43.38,46.32 v42.98,46.73 43.37,46.33 IC22.5 | IC22.4 42.87,46.83 v42.38,47.33 | IC22.2 41.87,46.82 IC22.21 | IC22.1 41.37,46.32 v42.38,47.33 | v42.38,47.33 42.52,47.48 | IC22.18 IC22.21 | IC22.21 v42.38,47.33 | IC23.4 50.35,47.75 v50.6,48 50.35,48.25 IC23.3 47.9,48.25 C148.2 | IC23.6 50.25,46.75 | 50.25,46.75 v50.6,47.1 | IC23.7 50.25,46.75 | 50.25,46.75 v50.6,47.1 | IC23.8 50.75,46.95 v50.6,47.1 | IC23.9 51.25,46.85 v51.5,47.1 51.75,46.85 IC23.10 | IC23.11 52.25,46.95 v52.4,47.1 | IC23.12 52.75,46.75 | 52.75,46.75 v52.4,47.1 | IC23.13 52.75,46.75 | 52.75,46.75 v52.4,47.1 | IC23.15 51.75,47.75 IC23.25 | C109.1 21.65,45.9 v22.4,45.9 22.4,45.3 Q1.4 | LP1.2 43.85,34.7 | 43.85,34.7 LP1.3 | 41.95,34.7 LP3.3 | LP2.2 40.05,34.7 | 40.05,34.7 LP2.3 39.3,34.1 v39.2,34.2 | 43.85,34.7 41.95,34.7 | 41.95,34.7 40.05,34.7 | LP3.2 41.95,34.7 | IC33.31 53.75,79.5 53.75,79.25 IC33.33 | v57.3,75.5 57.23,75.56 IC33.16 56.75,76.02 56.7,76.07 56.7,76.3 v56.3,76.7 | v52.4,80.5 53.19,80.5 IC33.32 53.25,79.98 53.3,79.93 53.3,79.7 v53.7,79.3 | IC32.27 73.97,88 | 73.97,88 v73.88,88.1
  Top 0.3: IC32.26 74.47,87.5 73.97,88 | IC32.21 73.5,87.2 v73.25,87.45 | IC32.15 71.9,87.5 v71.95,87.45 | IC32.10 71.9,90 v71.95,90.05 | v63.85,88.75 63.85,89.5 64.2,89.85 | v83.85,87.75 83.45,88.15 82.75,88.15 | C168.1 v74.25,95.75 74.3,95.8 R83.1 | R77.1 v75.75,95.75 | C176.1 R82.1 v68.25,96.75 | C187.1 R85.1 69.4,80.3 v68.85,79.75 68,80.6 R86.1 | R78.1 v73.25,80.95 | R79.1 C182.1 77.85,83 v77.85,83.15 | R80.1 77.5,78.9 | 77.5,78.9 v77.45,78.85 | C177.2 82.55,88.25 80.9,89.9 X4.5 80.8,91.6 X4.M4 X4.M1 | v86.45,88.55 86.95,89.05 X4.M3 X4.M2 | U2.P13 29.75,69.55 v29.7,69.6 | U2.P25 35.75,69.55 v35.7,69.6 | U2.P130 22.85,77.25 v23.1,77 | U2.P136 22.95,74.25 v23.3,73.9 | U2.P108 23.75,90.95 23.6,91.1 v22.9,91.1 | U2.P113 23.15,85.75 v23.2,85.7 | U2.P96 29.75,88.65 v30,88.4 | U2.P91 32.25,88.55 v32.1,88.4 | U2.P73 41.25,88.45 v41.2,88.4 | U2.P77 39.25,88.45 v39.2,88.4 | U2.P54 42.35,78.75 v41.8,79.3 | U2.P49 42.45,76.25 v41.7,75.5 | U4.4 v51.91,90.41 v51.9,90.4 | U2.P68 44.95,85.75 v45.2,86 | U2.P60 41.95,81.75 v41.9,81.7 | U2.P3 24.75,66.75 v25,66.5 | IC9.17 v74,38.3 | IC27.21 72.33,11.97 | IC27.21 72.53,12.17 | IC27.21 72.06,11.7 71.8,11.7 | IC16.13 v42.5,31.1 | IC24.9 v56.2,40.5 | R110.2 76.85,78.25 77.5,78.9
  Top 0.6: C9.2 15.85,21.1 v15.8,21.1 | C9.2 C8.2 | C8.2 R11.2 | R11.2 C13.2 | C13.2 C12.2 | C12.2 15.85,29.8 v15.8,29.8 | v6.5,27.7 C6.2 2.5,26.35 2.5,26.5 | R1.1 v20,10.6 | R5.2 16,12 R8.2 15.85,13.25 v16,13.4 | R4.1 v16,3.5 | R2.2 v20,3.5 | T1.3 12.25,11.25 v13.2,10.3 | T1.4 13.31,14.71 v13.6,15 | L3.2 v11.9,44.5 13.5,44.5 | L11.2 v13,43 | C22.1 C23.1 | C23.1 4.15,53.95 v4.2,54 | 4.7,46.55 4,47.25 v4,47.7 2,47.7 2,47.5 | C30.1 15.6,61.1 v15.7,61 18,61 | C17.1 5,70.3 v4.2,71.1 4.17,71.13 C29.1 2.5,73.3 2.5,73.5 | v9.7,68.9 10.55,68.9 C19.2 | v80,11.7 R9.1 81.15,9.35 v81.5,9 | R13.1 v84,10.5 84.5,11 R24.2 | R10.2 v80,3.4 | R21.2 v84,3.4 | T2.3 92.52,11.29 v92.6,11.2 | T2.4 92.48,14.71 v92.5,14.7 | C38.2 86.5,27.2 v86.45,27.25 | v95.85,20.75 C40.2 C41.2 R25.2 C44.2 C43.2 v95.85,29.75 | L17.2 92.35,44.75 v92.4,44.8 | L18.2 v93.8,43 | C48.1 C49.1 84.15,53.85 v84.2,53.9 | C64.1 84.1,73.25 v84.1,71.7 84.1,70.2 C61.1 | v89.5,69.2 90.35,69.2 C62.2 v90.7,70.8 | C54.1 v95.8,61.1 | R64.1 49.14,17.34 v49.2,17.4 | v49.2,11.4 49.6,11 R60.2 C135.2 49.65,8.57 C136.1 | v65.3,14.5 C122.2 C133.2 63.85,9 C145.2 | C134.2 v65.3,13 | R61.1 v65.3,11.5 | R67.1 v63.5,2.9 | v77.5,33.9 C73.2 | C72.2 v79,33.9 | v66.9,39 C70.2 | v64,33 T3.2 | v64,31.8 64.05,31.75 T3.3 | v67.4,31.7 68.67,31.7 T3.4 | L27.2 66.19,42.69 v66.1,42.6 | C75.2 C76.2 68.15,44.75 v68.1,44.8 | R41.2 v80,40.5 | L28.2 68.41,50.1 v69.7,50.1 | C86.1 76.1,62.7 v77.9,62.7 | C112.2 48.2,59.4 v48.2,60.6 | C111.2 52.7,59.4 v52.7,60.6 | v55.2,59.6 55.25,59.65 C96.1 56.8,59.35 v56.8,58.5 57.1,58.5 | C103.2 57.6,58.5 57.1,58.5 | C93.1 C81.1 C80.1 57.1,58.5 | C94.2 v58.4,66.5 | C84.2 75.75,56.15 v75.8,56.1 | C114.2 C116.2 R53.1 C115.2 30.5,31.85 C129.2 33.5,31.85 R57.1 v34,32.6
  Top 0.6: C118.1 31,18.15 30.5,18.15 | 30.5,18.15 C117.2 R52.2 | 30.5,18.15 v30.5,16.8 | C127.2 R56.1 21.65,21.85 v25,18.5 | v59.8,42.7 59.85,42.65 C152.2 C151.2 59.85,38.85 v59.9,38.8 | C143.2 v55,18.7 | C138.2 v58,18.3 | v60.9,28.2 59.55,28.2 R72.1 58.05,28.15 v58,28.1 | C120.2 21.65,27.35 v22,27.7 | C97.2 v21.5,52 22,52.5 | C105.1 v31,52.5 | v31,52.5 26.7,52.5 | 26.7,52.5 23.2,52.5 | 23.2,52.5 22,52.5 | C99.2 26.65,52.45 26.7,52.5 | C98.2 23.15,52.45 23.2,52.5 | R75.1 37.35,49.5 R73.2 37.15,47.8 C149.2 v36.1,46.5 35.65,46.5 C102.2 | C100.2 31.65,36.85 v31.6,36.8 | v3.9,82 3.88,82.03 J1.GND1 0.62,82.03 v0.6,82 | v3.9,85 3.88,84.97 J1.GND2 0.62,84.97 v0.6,85 | v0.6,86.5 0.62,86.53 J2.GND1 3.88,86.53 v3.9,86.5 | v0.6,89.5 0.62,89.47 J2.GND2 3.88,89.47 v3.9,89.5 | IC13.21 v30.93,45.63 v30.93,45.62 | IC10.9 64.11,52.48 v63.69,52.9 | C26.2 v12.5,54.9 | v6.5,4.8 6.5,4 | 6.5,4 6.5,2.2 | 6.5,2.2 X2.G@3 | v7.4,4.8 7.4,3.1 6.5,2.2 | v5.6,4.8 5.6,3.1 6.5,2.2 | v4.6,4 6.5,4 | v4.6,0.6 6.2,0.6 6.5,0.9 6.5,2.2 | v12.6,4.8 12.6,3.01 X2.G@4 | v13.5,4.8 X2.G@4 | v14.4,4.8 14.4,3.02 X2.G@4 | v86.5,4.8 X1.G@3 | X1.G@3 87.4,3.01 v87.4,4.8 | v85.6,4.8 85.6,3.02 X1.G@3 | v92.6,4.8 92.6,3.01 X1.G@4 | v93.5,4.8 93.5,2.5 | 93.5,2.5 X1.G@4 | v94.4,4.8 94.4,3.9 | 94.4,3.9 94.4,3.02 X1.G@4 | v95.4,3.8 94.5,3.8 94.4,3.9 | v95.4,0.6 94.1,0.6 94,0.5 93.9,0.5 93.5,0.9 93.5,2.5 | C12.2 17.5,28.5 | C13.2 17.5,27 | R11.2 18,25.5 | C8.2 18,24 | C9.2 17.5,22.5 | C23.1 2,52.5 2,53 | 22,52.5 22,53 31,53 v31,52.5
  Top 0.8: v47.75,93.55 v47.75,92.65 48.55,92.65 C190.2 48.55,93.55 v47.75,93.55
  Top 1: C174.2 98.45,82.95 v98.45,82.15 v94.85,82.15 94.85,82.75 C181.2 95.75,83.15 v95.75,82.15
  Top 1.5: C171.2 C170.2 82.75,88.15 C177.2 | C169.2 C172.2 C184.2 C180.2 | C169.2 64.2,89.85 | 64.2,89.85 C173.2 64.2,89.85 | C180.2 C169.2 | C180.2 64.2,87.65 | 64.2,87.65 C185.2 | 64.2,89.85 64.2,87.65 | C190.2 C189.2
  Bottom 0.3: v50.7,5 51.35,5 | v25,18.5 25.3,18.5 | C191.2 v57.3,75.5 | R112.1 C207.2 | C210.2 R113.1 | R111.1 42.9,75.15 C205.2 | TP8.TP 13,55.4 v12.5,54.9 | v30.5,33.3 30.5,33.5 TP14.TP | TP12.TP 75.7,56 v75.8,56.1 | TP10.TP 93,55.2 v92.5,54.7 | TP6.TP 23.9,85 v23.2,85.7